# EAGLE board gd32 (EAGLE 9.6.2), part 1 of 2
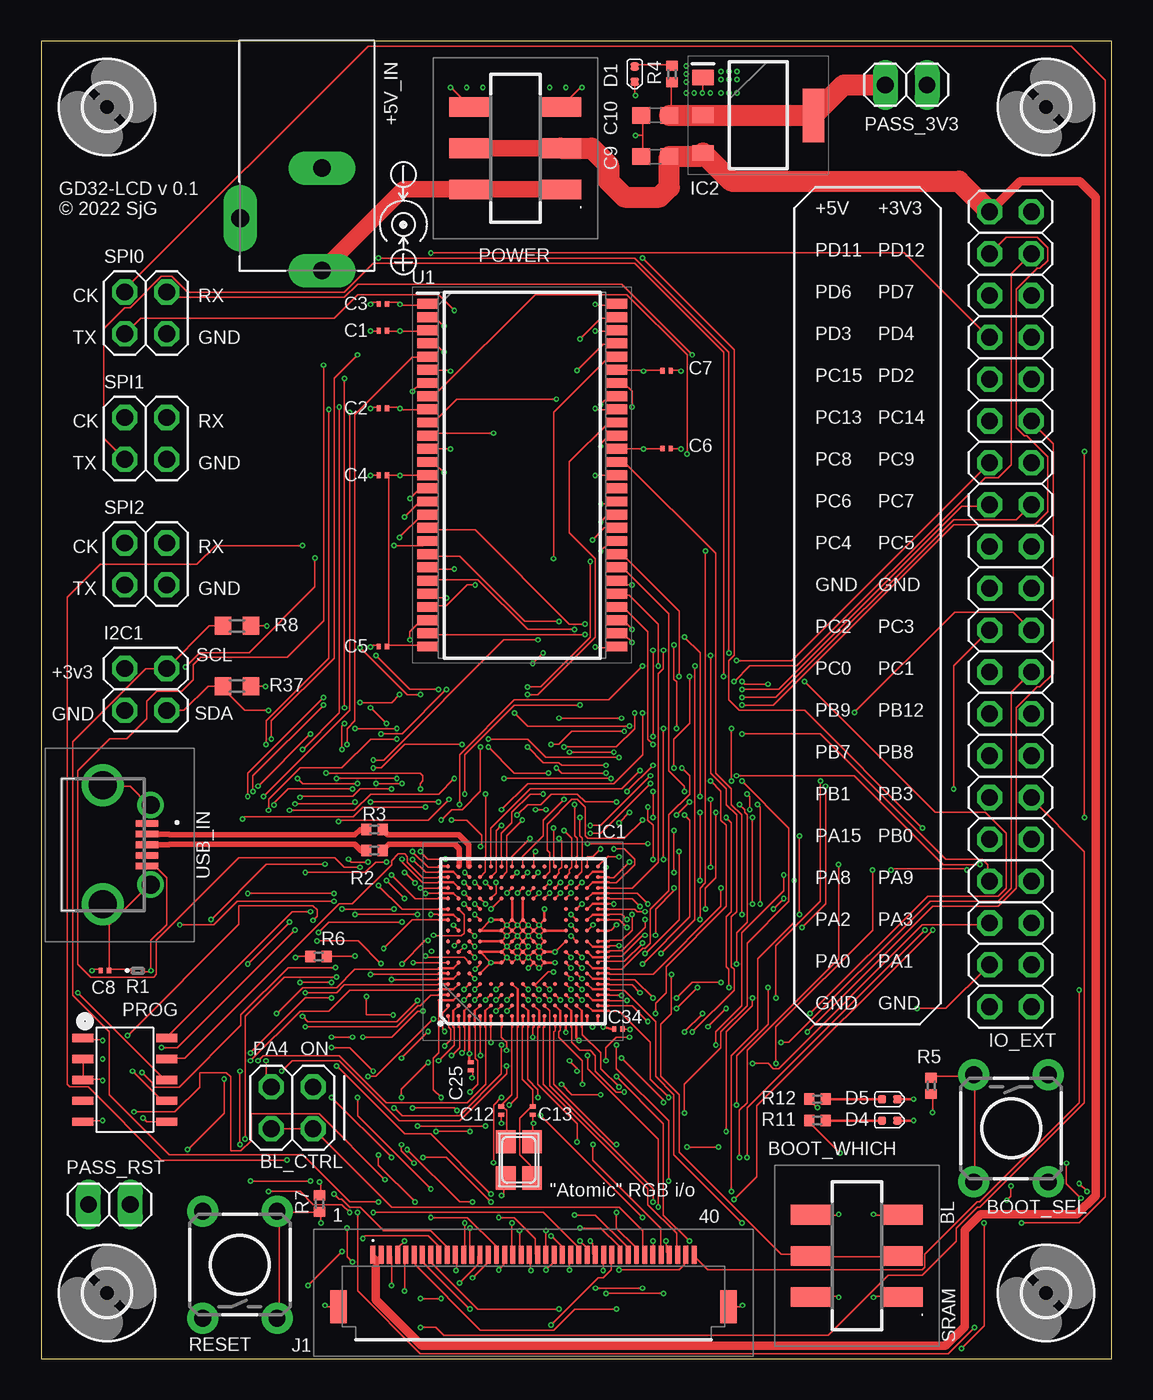
[diagram p5: board, top side]
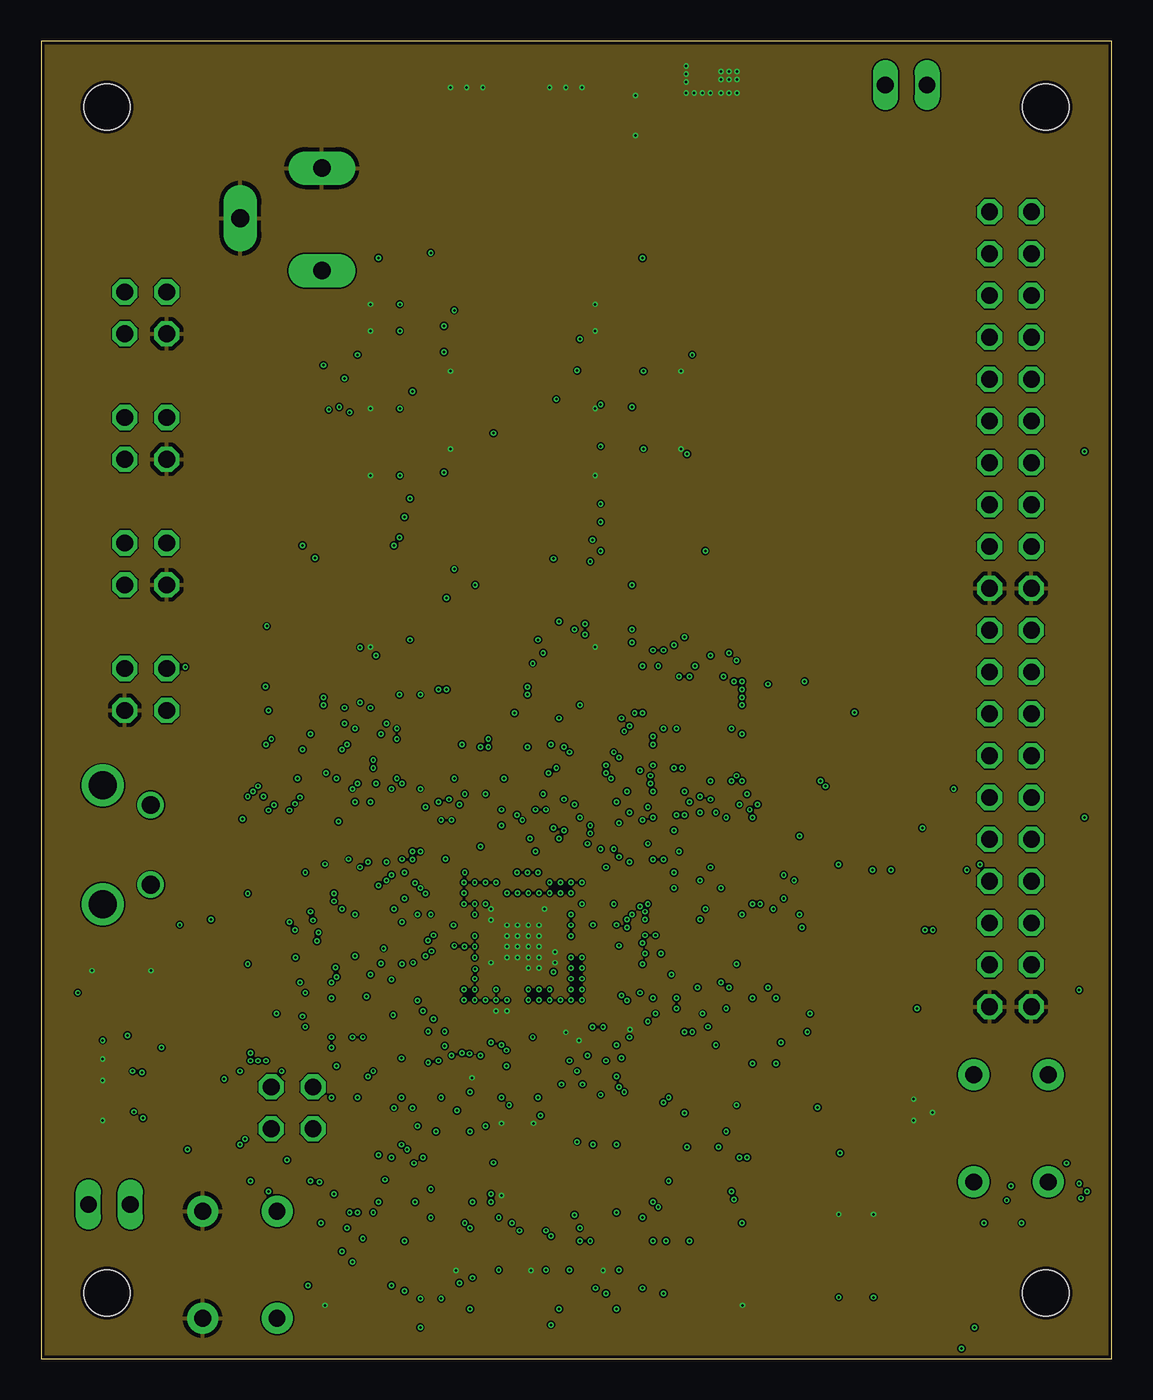
[diagram p6: board, inner layer Route2]
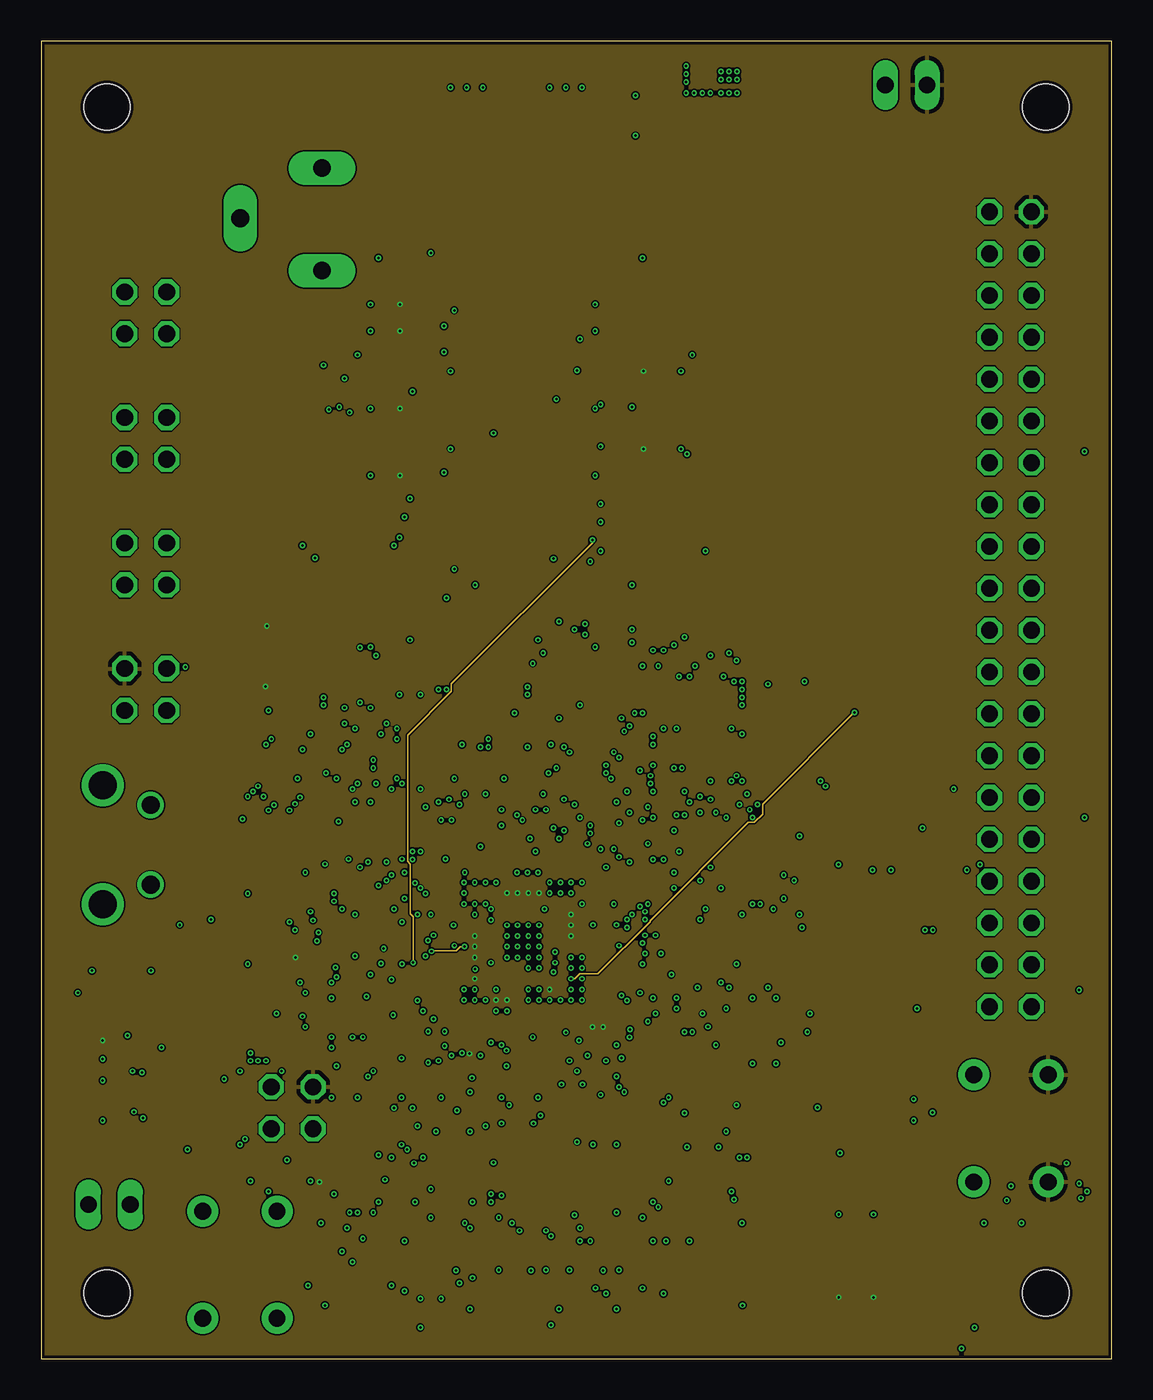
[diagram p7: board, inner layer Route15]
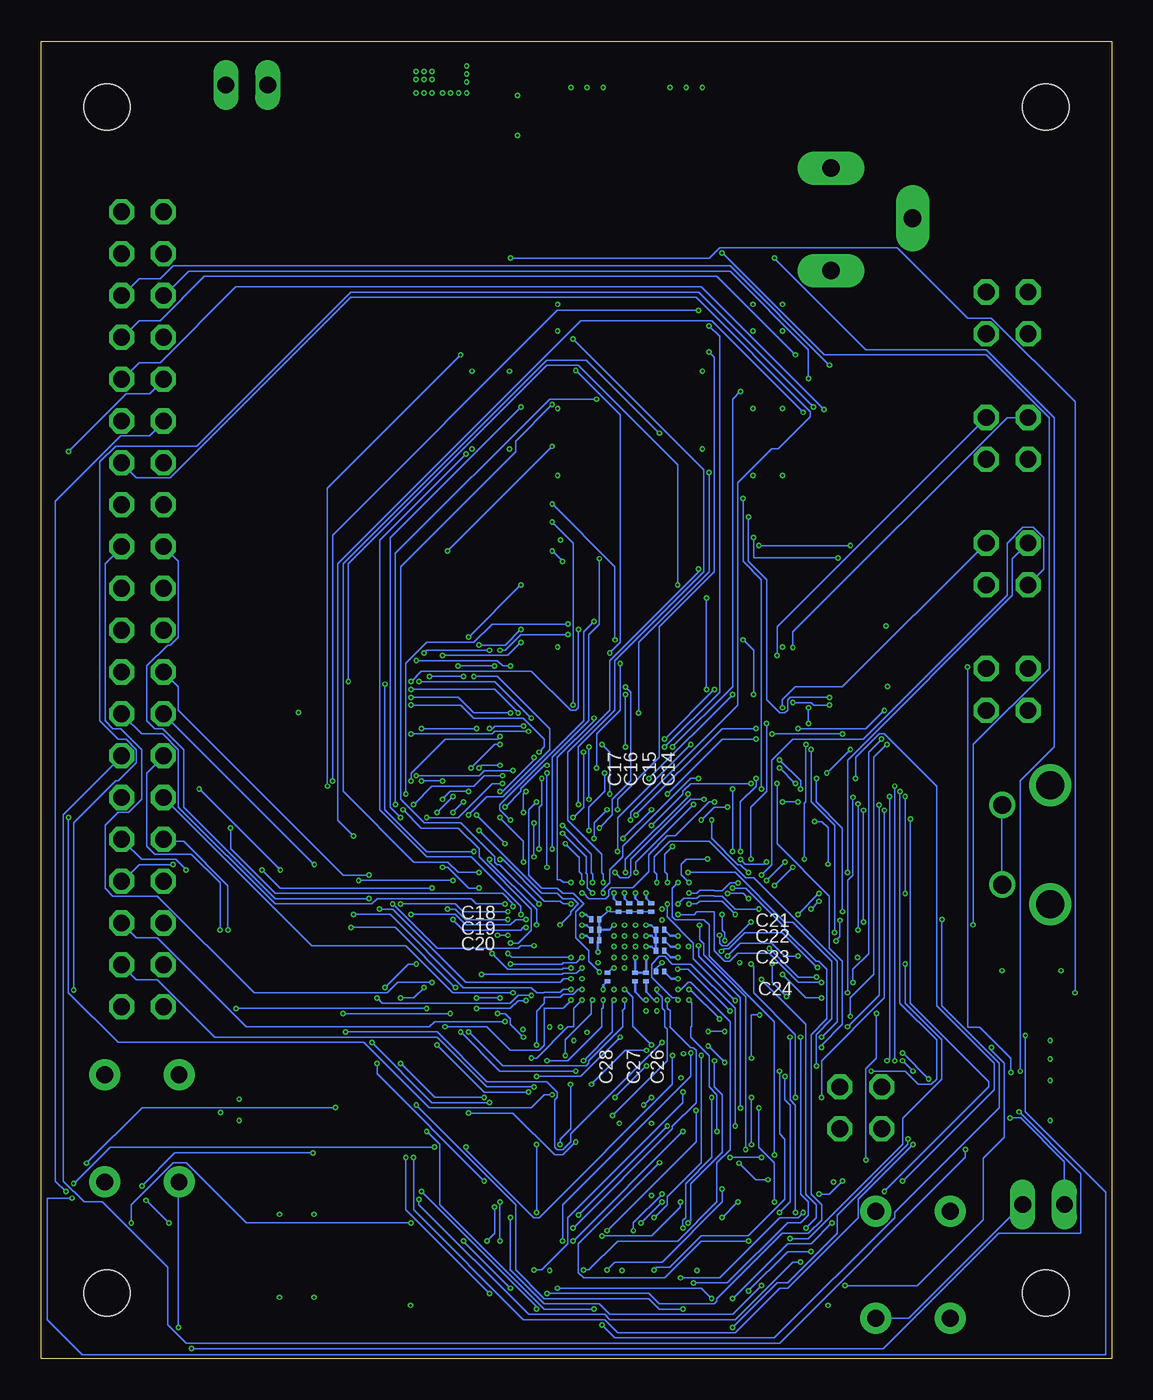
[diagram p8: board, bottom side, seen from below]

Size 65 x 80 mm. Coordinates in mm from the lower left corner, seen from the top.
Outline: 0,0 65,0 65,80 0,80 0,0
Copper layers (1+2*15+16): Top 0.0175mm / dielectric 0.12mm / Route2 0.0175mm / dielectric 0.465mm / Route15 0.0175mm / dielectric 0.12mm / Bottom 0.035mm
Design rules "nextpcb-3.5mil-4layer *": minimum track width 3.5mil, minimum drill 0.15mm, track to track 3.5mil, track to pad 3.5mil, pad to pad 3.5mil, via to via 3.5mil, smd to smd 3.5mil, copper to edge 0.2mm, drill to drill 3.5mil, minimum pad ring 3.5mil, minimum via ring 3.5mil, stop-mask expansion 4mil, vias tented up to drill 0mil, thermal gap 10mil
Net classes: 0 default: width 0.089 mm; 1 USB: width 0.33 mm, clearance 0.102 mm to class 0, clearance 0.254 mm

## Footprints (pad centres in the part's own frame; a part is rotated, then mirrored left to right if it is on the bottom)
DCJ3P-14.2X11.0X9.0MM = drill 1.067 pad 2.032 long: + 3.175,0; -1 -3.048,0; -2 0,-4.953
2X02 = drill 1.016 octagon: 1 -1.27,-1.27; 2 -1.27,1.27; 3 1.27,-1.27; 4 1.27,1.27
TACTILE-PTH = drill 1.016 pad 1.88: 1 -3.251,2.261; 2 3.251,2.261; 3 -3.251,-2.261; 4 3.251,-2.261
JS202011SCQN = smd 1.2 x 2.5: 1 -2.5,-2.75; 2 0,-2.75; 3 2.5,-2.75; 4 2.5,2.75; 5 0,2.75; 6 -2.5,2.75
C0201 = smd 0.25 x 0.35: 1 -0.25,0; 2 0.25,0
C0603 = smd 1.1 x 1: 1 -0.85,0; 2 0.85,0
LED-0402 = smd 0.5 x 0.5: + -0.463,0; - 0.463,0
2,8 = hole 2.8: 0,0
BGA201C65P15X15_1000X1000X84 = smd 0.25 x 0.25: A1 -4.55,4.55; A2 -3.9,4.55; A3 -3.25,4.55; A4 -2.6,4.55; A5 -1.95,4.55; A6 -1.3,4.55; A7 -0.65,4.55; A8 0,4.55; A9 0.65,4.55; A10 1.3,4.55; A11 1.95,4.55; A12 2.6,4.55; A13 3.25,4.55; A14 3.9,4.55; A15 4.55,4.55; B1 -4.55,3.9; B2 -3.9,3.9; B3 -3.25,3.9; B4 -2.6,3.9; B5 -1.95,3.9; B6 -1.3,3.9; B7 -0.65,3.9; B8 0,3.9; B9 0.65,3.9; B10 1.3,3.9; B11 1.95,3.9; B12 2.6,3.9; B13 3.25,3.9; B14 3.9,3.9; B15 4.55,3.9; C1 -4.55,3.25; C2 -3.9,3.25; C3 -3.25,3.25; C4 -2.6,3.25; C5 -1.95,3.25; C6 -1.3,3.25; C7 -0.65,3.25; C8 0,3.25; C9 0.65,3.25; C10 1.3,3.25; C11 1.95,3.25; C12 2.6,3.25; C13 3.25,3.25; C14 3.9,3.25; C15 4.55,3.25; D1 -4.55,2.6; D2 -3.9,2.6; D3 -3.25,2.6; D4 -2.6,2.6; D5 -1.95,2.6; D6 -1.3,2.6; D7 -0.65,2.6; D8 0,2.6; D9 0.65,2.6; D10 1.3,2.6; D11 1.95,2.6; D12 2.6,2.6; D13 3.25,2.6; D14 3.9,2.6; D15 4.55,2.6; E1 -4.55,1.95; E2 -3.9,1.95; E3 -3.25,1.95; E4 -2.6,1.95; E12 2.6,1.95; E13 3.25,1.95; E14 3.9,1.95; E15 4.55,1.95; F1 -4.55,1.3; F2 -3.9,1.3; F3 -3.25,1.3; F4 -2.6,1.3; F6 -1.3,1.3; F7 -0.65,1.3; F8 0,1.3; F9 0.65,1.3; F10 1.3,1.3; F12 2.6,1.3; F13 3.25,1.3; F14 3.9,1.3; F15 4.55,1.3; G1 -4.55,0.65; G2 -3.9,0.65; G3 -3.25,0.65; G4 -2.6,0.65; G6 -1.3,0.65; G7 -0.65,0.65; G8 0,0.65; G9 0.65,0.65; G10 1.3,0.65; G12 2.6,0.65; G13 3.25,0.65; G14 3.9,0.65; G15 4.55,0.65; H1 -4.55,0; H2 -3.9,0; H3 -3.25,0; H4 -2.6,0; H6 -1.3,0; H7 -0.65,0; H8 0,0; H9 0.65,0; H10 1.3,0; H12 2.6,0; H13 3.25,0; H14 3.9,0; H15 4.55,0; J1 -4.55,-0.65; J2 -3.9,-0.65; J3 -3.25,-0.65; J4 -2.6,-0.65; J6 -1.3,-0.65; J7 -0.65,-0.65; J8 0,-0.65; J9 0.65,-0.65; J10 1.3,-0.65; J12 2.6,-0.65; J13 3.25,-0.65; J14 3.9,-0.65; J15 4.55,-0.65; K1 -4.55,-1.3; K2 -3.9,-1.3; K3 -3.25,-1.3; K4 -2.6,-1.3; K6 -1.3,-1.3; K7 -0.65,-1.3; K8 0,-1.3; K9 0.65,-1.3; K10 1.3,-1.3; K12 2.6,-1.3; K13 3.25,-1.3; K14 3.9,-1.3; K15 4.55,-1.3; L1 -4.55,-1.95; L2 -3.9,-1.95; L3 -3.25,-1.95; L4 -2.6,-1.95; L12 2.6,-1.95; L13 3.25,-1.95; L14 3.9,-1.95; L15 4.55,-1.95; M1 -4.55,-2.6; M2 -3.9,-2.6; M3 -3.25,-2.6; M4 -2.6,-2.6; M5 -1.95,-2.6; M6 -1.3,-2.6; M7 -0.65,-2.6; M8 0,-2.6; M9 0.65,-2.6; M10 1.3,-2.6; M11 1.95,-2.6; M12 2.6,-2.6; M13 3.25,-2.6; M14 3.9,-2.6; M15 4.55,-2.6; N1 -4.55,-3.25; N2 -3.9,-3.25; N3 -3.25,-3.25; N4 -2.6,-3.25; N5 -1.95,-3.25; N6 -1.3,-3.25; N7 -0.65,-3.25; N8 0,-3.25; N9 0.65,-3.25; N10 1.3,-3.25; N11 1.95,-3.25; N12 2.6,-3.25; N13 3.25,-3.25; N14 3.9,-3.25; N15 4.55,-3.25; P1 -4.55,-3.9; P2 -3.9,-3.9; P3 -3.25,-3.9; P4 -2.6,-3.9; P5 -1.95,-3.9; P6 -1.3,-3.9; P7 -0.65,-3.9; P8 0,-3.9; P9 0.65,-3.9; P10 1.3,-3.9; P11 1.95,-3.9; P12 2.6,-3.9; P13 3.25,-3.9; P14 3.9,-3.9; P15 4.55,-3.9; R1 -4.55,-4.55; R2 -3.9,-4.55; R3 -3.25,-4.55; R4 -2.6,-4.55; R5 -1.95,-4.55; R6 -1.3,-4.55; R7 -0.65,-4.55; R8 0,-4.55; R9 0.65,-4.55; R10 1.3,-4.55; R11 1.95,-4.55; R12 2.6,-4.55; R13 3.25,-4.55; R14 3.9,-4.55; R15 4.55,-4.55
SOT229P700X180-4N = smd 1.3 x 0.95: 1 -3.35,2.29; 2 -3.35,0; 3 -3.35,-2.29 | smd 1.3 x 3.25: 4 3.35,0
2X20 = drill 1.016 octagon: 1 -24.13,-1.27; 2 -24.13,1.27; 3 -21.59,-1.27; 4 -21.59,1.27; 5 -19.05,-1.27; 6 -19.05,1.27; 7 -16.51,-1.27; 8 -16.51,1.27; 9 -13.97,-1.27; 10 -13.97,1.27; 11 -11.43,-1.27; 12 -11.43,1.27; 13 -8.89,-1.27; 14 -8.89,1.27; 15 -6.35,-1.27; 16 -6.35,1.27; 17 -3.81,-1.27; 18 -3.81,1.27; 19 -1.27,-1.27; 20 -1.27,1.27; 21 1.27,-1.27; 22 1.27,1.27; 23 3.81,-1.27; 24 3.81,1.27; 25 6.35,-1.27; 26 6.35,1.27; 27 8.89,-1.27; 28 8.89,1.27; 29 11.43,-1.27; 30 11.43,1.27; 31 13.97,-1.27; 32 13.97,1.27; 33 16.51,-1.27; 34 16.51,1.27; 35 19.05,-1.27; 36 19.05,1.27; 37 21.59,-1.27; 38 21.59,1.27; 39 24.13,-1.27; 40 24.13,1.27
CF5040FD0R005NH = smd 0.3 x 1.1: 1 -9.75,2.575; 2 -9.25,2.575; 3 -8.75,2.575; 4 -8.25,2.575; 5 -7.75,2.575; 6 -7.25,2.575; 7 -6.75,2.575; 8 -6.25,2.575; 9 -5.75,2.575; 10 -5.25,2.575; 11 -4.75,2.575; 12 -4.25,2.575; 13 -3.75,2.575; 14 -3.25,2.575; 15 -2.75,2.575; 16 -2.25,2.575; 17 -1.75,2.575; 18 -1.25,2.575; 19 -0.75,2.575; 20 -0.25,2.575; 21 0.25,2.575; 22 0.75,2.575; 23 1.25,2.575; 24 1.75,2.575; 25 2.25,2.575; 26 2.75,2.575; 27 3.25,2.575; 28 3.75,2.575; 29 4.25,2.575; 30 4.75,2.575; 31 5.25,2.575; 32 5.75,2.575; 33 6.25,2.575; 34 6.75,2.575; 35 7.25,2.575; 36 7.75,2.575; 37 8.25,2.575; 38 8.75,2.575; 39 9.25,2.575; 40 9.75,2.575 | smd 1 x 2: MP1 -11.85,-0.575; MP2 11.85,-0.575
1X02 = drill 1.016 long: 1 -1.27,0; 2 1.27,0
SWD_DEBUG = smd 0.508 x 1.27: P1 -2.54,-2.54; P2 -2.54,2.54; P3 -1.27,-2.54; P4 -1.27,2.54; P5 0,-2.54; P6 0,2.54; P7 1.27,-2.54; P8 1.27,2.54; P9 2.54,-2.54; P10 2.54,2.54
NX3225 = smd 1.4 x 1.2: 1 -1.1,-0.8; 2 1.1,-0.8; 3 1.1,0.8; 4 -1.1,0.8
ERJ1GN_(0201) = smd 0.25 x 0.3: 1 -0.3,0; 2 0.3,0
R0402 = smd 0.6 x 0.7: 1 -0.5,0; 2 0.5,0
R0603 = smd 1 x 1.1: 1 -0.85,0; 2 0.85,0
SOP80P1176X120-54N = smd 1.295 x 0.6: 1 -5.728,10.4; 2 -5.728,9.6; 3 -5.728,8.8; 4 -5.728,8; 5 -5.728,7.2; 6 -5.728,6.4; 7 -5.728,5.6; 8 -5.728,4.8; 9 -5.728,4; 10 -5.728,3.2; 11 -5.728,2.4; 12 -5.728,1.6; 13 -5.728,0.8; 14 -5.728,0; 15 -5.728,-0.8; 16 -5.728,-1.6; 17 -5.728,-2.4; 18 -5.728,-3.2; 19 -5.728,-4; 20 -5.728,-4.8; 21 -5.728,-5.6; 22 -5.728,-6.4; 23 -5.728,-7.2; 24 -5.728,-8; 25 -5.728,-8.8; 26 -5.728,-9.6; 27 -5.728,-10.4; 28 5.728,-10.4; 29 5.728,-9.6; 30 5.728,-8.8; 31 5.728,-8; 32 5.728,-7.2; 33 5.728,-6.4; 34 5.728,-5.6; 35 5.728,-4.8; 36 5.728,-4; 37 5.728,-3.2; 38 5.728,-2.4; 39 5.728,-1.6; 40 5.728,-0.8; 41 5.728,0; 42 5.728,0.8; 43 5.728,1.6; 44 5.728,2.4; 45 5.728,3.2; 46 5.728,4; 47 5.728,4.8; 48 5.728,5.6; 49 5.728,6.4; 50 5.728,7.2; 51 5.728,8; 52 5.728,8.8; 53 5.728,9.6; 54 5.728,10.4
U254051T4BHJ25S2S = smd 0.4 x 1.35: 1 -1.3,0.675; 2 -0.65,0.675; 3 0,0.675; 4 0.65,0.675; 5 1.3,0.675 | drill 1.7 pad 2.3: MH1 -3.6,-2; MH2 3.6,-2 | drill 1.07 pad 1.4: MH3 2.425,0.9; MH4 -2.425,0.9

## Placement (x,y rotation side)
+5V_IN  DC-005  [DCJ3P-14.2X11.0X9.0MM]  17.04,69.25 270 top
BL_CTRL  [2X02]  15.24,15.24 180 top
BOOT_SEL  B3F-1005  [TACTILE-PTH]  58.88,13.99 270 top
BOOT_WHICH  JS202011SCQN  [JS202011SCQN]  49.52,6.25 90 top
C1  0.1uF  [C0201]  20.75,62.42 180 top
C2  0.1uF  [C0201]  20.75,57.71 180 top
C3  0.1uF  [C0201]  20.75,64.05 180 top
C4  0.1uF  [C0201]  20.75,53.65 180 top
C5  0.1uF  [C0201]  20.75,43.25 180 top
C6  0.1uF  [C0201]  37.98,55.27 0 top
C7  0.1uF  [C0201]  37.98,59.99 0 top
C8  4.7nF / 50V  [C0201]  3.87,23.57 180 top
C9  10uF/16v  [C0603]  37.29,73 180 top
C10  10uF/16v  [C0603]  37.29,75.5 180 top
C12  15pF  [C0201]  27.94,15.07 270 top
C13  15pF  [C0201]  29.84,15.07 270 top
C14  0.1uF  [C0201]  27.96,27.4 270 bottom
C15  0.1uF  [C0201]  28.62,27.4 270 bottom
C16  0.1uF  [C0201]  29.29,27.4 270 bottom
C17  0.1uF  [C0201]  29.95,27.4 270 bottom
C18  0.1uF  [C0201]  31.36,26.68 0 bottom
C19  0.1uF  [C0201]  31.36,26.05 0 bottom
C20  0.1uF  [C0201]  31.36,25.41 0 bottom
C21  0.1uF  [C0201]  27.43,26.05 180 bottom
C22  0.1uF  [C0201]  27.43,25.41 180 bottom
C23  0.1uF  [C0201]  27.43,24.78 180 bottom
C24  0.1uF  [C0201]  27.43,23.51 180 bottom
C25  0.1uF  [C0201]  26.08,17.77 270 top
C26  0.1uF  [C0201]  28.28,23.18 90 bottom
C27  0.1uF  [C0201]  28.94,23.18 90 bottom
C28  0.1uF  [C0201]  30.61,23.18 90 bottom
C34  0.1uF  [C0201]  35.05,20.02 0 top
D1  GRN-0402  [LED-0402]  36.04,78 270 top
D4  GRN-0402  [LED-0402]  51.51,14.46 0 top
D5  GRN-0402  [LED-0402]  51.51,15.76 0 top
H1  MOUNT-HOLE2.8  [2,8]  4,76 0 top
H2  MOUNT-HOLE2.8  [2,8]  4,4 0 top
H3  MOUNT-HOLE2.8  [2,8]  61,4 0 top
H4  MOUNT-HOLE2.8  [2,8]  61,76 0 top
I2C1  [2X02]  6.35,40.64 270 top
IC1  GD32F450  [BGA201C65P15X15_1000X1000X84]  29.25,25.35 90 top
IC2  AMS1117-3.3  [SOT229P700X180-4N]  43.54,75.5 0 top
IO_EXT  [2X20]  58.85,45.51 270 top
J1  LCD  [CF5040FD0R005NH]  29.89,3.73 0 top
PASS_3V3  [1X02]  52.52,77.34 180 top
PASS_RST  [1X02]  4.14,9.37 0 top
POWER  JS202011SCQN  [JS202011SCQN]  28.79,73.5 90 top
PROG  GD32_DEBUG  [SWD_DEBUG]  5.08,16.93 270 top
Q2  8MHz  [NX3225]  29,12.08 270 top
R1  1M  [ERJ1GN_(0201)]  5.87,23.57 0 top
R2  22R  [R0402]  20.23,30.86 180 top
R3  22R  [R0402]  20.23,32.13 180 top
R4  470R  [R0402]  38.29,78 90 top
R5  10K  [R0402]  54.04,16.57 90 top
R6  10K  [R0402]  16.85,24.43 180 top
R7  10K  [R0402]  16.9,9.43 90 top
R8  1K5  [R0603]  11.89,44.5 0 top
R11  470R  [R0402]  47.12,14.46 0 top
R12  470R  [R0402]  47.12,15.76 0 top
R37  1K5  [R0603]  11.89,40.84 0 top
RESET  B3F-1005  [TACTILE-PTH]  12.06,5.71 90 top
SPI0  [2X02]  6.35,63.5 0 top
SPI1  [2X02]  6.35,55.88 0 top
SPI2  [2X02]  6.35,48.26 0 top
U1  W9825G6KH-5  [SOP80P1176X120-54N]  29.2,53.65 0 top
USB_IN  U254-051T-4BHJ25-S2S  [U254051T4BHJ25S2S]  5.75,31.21 270 top

## Tracks (layer width: path | path; a pad name or v marks a point on that pad's centre or on a via)
!RST!  (via drill 0.15)
  Top 0.089: 14.45,8.89 14.45,2.54 RESET.3 | v29.84,19.53 29.84,20.16 29.9,20.16 | v34.92,17.14 37.78,14.29 37.78,8.73 v39.37,7.14 | v33.66,4.29 v36.51,4.29 | v23.02,3.65 v24.29,3.65 | v16.99,8.26 16.99,8.89 R7.1 16.83,8.89 14.45,8.89 | 14.45,8.89 RESET.4
  Top 0.152: IC1.J1 29.9,20.16
  Bottom 0.089: v29.84,19.53 32.23,17.14 v34.92,17.14 | v36.51,4.29 v39.37,7.14 | v33.66,4.29 24.92,4.29 v24.29,3.65 | v23.02,3.65 19.68,6.99 18.26,6.99 v16.99,8.26 | PASS_RST.2 12.32,2.46 RESET.3
+3V3  (via drill 0.15)
  Top 0.089: 21.11,43.34 23.34,43.34 U1.27 | C6.1 37.62,55.24 36.67,55.24 v36.56,55.25 36.51,55.24 35.08,55.24 U1.43 | C2.1 21.11,57.78 21.75,57.78 v21.77,57.69 21.91,57.63 23.34,57.63 U1.9 | C7.1 37.62,60.01 36.67,60.01 v36.56,59.96 36.51,60.01 35.08,60.01 U1.49 | C1.1 21.11,62.39 21.75,62.39 v21.77,62.4 21.91,62.39 23.34,62.39 U1.3 | C3.1 21.11,64.14 21.75,64.14 v21.77,64.03 21.91,63.98 23.34,63.98 U1.1 | R7.2 16.99,10 16.99,10.64 v16.9,10.72 | R6.2 16.19,24.45 15.56,24.45 v15.44,24.38 | PROG.P1 2.54,19.37 3.65,19.37 v3.74,19.34 | U1.14 23.34,53.66 21.91,53.66 v21.77,53.62 21.75,53.66 21.11,53.66 C4.1 21.11,53.5 21.11,43.34 | 21.11,43.34 C5.1 | BOOT_WHICH.6 46.83,3.81 48.42,3.81 v48.42,3.74 | BOOT_WHICH.1 52.23,3.81 50.64,3.81 v50.54,3.74 | R8.2 13.68,44.5 v13.7,44.48 | R37.2 13.6,40.84 v13.62,40.82
  Top 0.152: IC1.C9 v26.32,25.68 | IC1.C8 v26.32,25.02 | IC1.C7 v26.32,24.38 | IC1.C5 v26.32,23.07 | IC1.F3 v27.62,21.77 | IC1.G3 v28.27,21.77 | IC1.K4 v30.88,22.43 | IC1.N8 v32.17,25.68 | IC1.N9 v32.17,26.32 | IC1.N10 v32.17,26.98 | IC1.J13 v29.57,28.27 | IC1.H13 v28.93,28.27 | IC1.G13 v28.27,28.27 | IC1.J12 v30.23,28.27 | IC1.P1 33.15,20.48 v33.48,20.15 | IC1.R1 33.8,20.48 v34.12,20.15 34.77,19.99 C34.1 | IC1.C1 v26,18.52 26,18.09 C25.1
  Bottom 0.152: C21.1 26.8,25.68 v26.32,25.68 | C22.1 26.79,25.02 v26.32,25.02 | C23.1 26.77,24.38 v26.32,24.38 | C24.1 26.74,23.07 v26.32,23.07 | v27.62,21.77 27.77,21.77 28.28,22.29 C26.1 | C27.1 28.94,22.29 28.43,21.77 v28.27,21.77 | C28.1 30.88,22.67 v30.88,22.43 | C20.1 31.87,25.68 v32.17,25.68 | C19.1 31.89,26.32 v32.17,26.32 | C18.1 31.9,26.98 v32.17,26.98 | C16.1 29.57,27.93 v29.57,28.27 | C15.1 28.93,27.95 v28.93,28.27 | C14.1 28.27,27.96 v28.27,28.27 | C17.1 30.23,27.92 v30.23,28.27
  pour Route15: -3,83 68,83 68,-2 -3,-2
+5V
  Top 0.254: 20.31,5.53 20.31,5.56 | J1.1 20.31,6.14 20.31,5.56 | 20.31,5.56 J1.2
  Top 0.508: IO_EXT.1 59.44,71.5 63.05,71.5 64.03,70.53 64.03,9.91 62.89,8.78 57.04,8.78 56.06,7.8 56.06,1.95 54.9,0.78 23.11,0.78 20.31,3.58 20.31,5.53
  Top 1.016: 39.98,73 IC2.3 | POWER.5 POWER.2
  Top 1.27: POWER.2 33.42,73.5 34.45,72.47 34.45,71.5 35.42,70.53 37.54,70.53 38.14,71.13 C9.1 39.98,73 | IC2.3 41.9,71.5 55.72,71.5 IO_EXT.1
BOOT0  (via drill 0.15)
  Top 0.089: R5.2 54.13,17.14 56.52,17.14 BOOT_SEL.3 56.67,17.14 56.67,10.79 BOOT_SEL.4 | v26.35,23.65 26.67,23.97 IC1.D6 | v23.18,21.11 22.86,21.11 21.27,19.53 v19.53,19.53 | v19.21,8.89 19.21,4.13 23.02,0.32 55.09,0.32 v56.67,1.91
  Bottom 0.089: v26.35,23.65 25.72,23.65 v23.18,21.11 | v19.53,19.53 19.53,15.72 19.21,15.4 v19.21,8.89 | v56.67,1.91 56.67,10.64 BOOT_SEL.4
GND  (via drill 0.15)
  Top 0.089: 36.51,74.3 36.51,75.41 C10.2 | 36.51,74.3 36.51,73.03 C9.2 | 2.54,16.99 2.54,18.1 PROG.P3 | R1.2 6.19,23.5 6.51,23.5 v6.66,23.56 6.67,23.65 6.67,25.4 7.62,26.35 7.62,29.21 6.99,29.84 6.51,29.84 USB_IN.5 | C8.2 3.49,23.65 3.17,23.65 v3.09,23.56 | C25.2 26.19,17.46 26.19,17.14 v26.16,17.06 | C12.2 27.94,14.45 v27.95,14.3 | C13.2 29.84,14.45 v29.9,14.3 29.84,14.29 29.84,13.34 Q2.4 | C34.2 35.4,20 35.72,20 v35.75,19.99 | C5.2 20.48,43.34 20,43.34 v19.99,43.23 | C4.2 20.48,53.66 20,53.66 v19.99,53.62 | C2.2 20.48,57.78 20,57.78 v19.99,57.69 | C6.2 38.26,55.24 38.73,55.24 v38.84,55.25 | C7.2 38.26,60.01 38.73,60.01 v38.84,59.96 | C1.2 20.48,62.39 20,62.39 v19.99,62.4 | C3.2 20.48,64.14 20,64.14 v19.99,64.03 | D1.- 36.04,77.47 36.04,76.83 v36.08,76.7 | R5.1 54.13,16.03 54.13,15.08 v54.11,14.95 | J1.11 25.24,6.19 25.24,5.4 v25.19,5.36 | J1.20 29.69,6.19 29.69,5.4 v29.74,5.36 | J1.29 34.13,6.19 34.13,5.4 v34.12,5.36 | PROG.P9 2.54,14.45 3.65,14.45 v3.74,14.46 | U1.28 34.92,43.18 33.66,43.18 v33.64,43.23 | U1.12 23.5,55.24 24.77,55.24 v24.86,55.25 | U1.6 23.5,60.01 24.77,60.01 v24.86,59.96 | U1.41 33.66,53.66 v33.64,53.62 | U1.46 34.92,57.63 33.66,57.63 v33.64,57.69 | U1.52 34.92,62.39 33.66,62.39 v33.64,62.4 | U1.54 34.92,63.98 33.66,63.98 v33.64,64.03 | IC2.1 40.16,77.79 40.16,76.99 v40.14,76.86 | Q2.2 28.1,10.95 28.1,9.84 v27.95,9.91 | 2.54,16.99 3.65,16.99 v3.74,16.9 | 2.54,16.99 PROG.P5 | 36.51,74.3 36.2,74.3 v36.08,74.26 | J1.MP1 17.94,3.17 17.3,3.17 v17.23,3.25 | J1.MP2 41.75,3.17 42.55,3.17 v42.58,3.25 | BOOT_WHICH.4 46.83,8.73 48.42,8.73 v48.42,8.78 | BOOT_WHICH.3 52.23,8.73 50.64,8.73 v50.54,8.78
  Top 0.089: POWER.4 26.04,76.04 24.92,77.15 v24.86,77.19 | POWER.3 31.59,76.04 32.7,77.15 v32.83,77.19
  Top 0.152: IC1.F12 v27.3,27.3 | IC1.G12 IC1.G10 | IC1.H12 IC1.H10 | IC1.J10 v30.23,26.32 | v30.23,26.32 IC1.K10 v30.55,27.3 | IC1.H10 v29.57,26.32 | IC1.H10 v28.93,26.32 | IC1.G10 v28.93,26.32 | IC1.G10 v28.27,26.32 | v28.27,26.32 IC1.F10 v27.3,26.65 IC1.D9 IC1.F9 | IC1.F9 v28.27,26.32 | IC1.F9 v28.27,25.68 | IC1.F8 v28.27,25.68 | IC1.F8 v28.27,25.02 | IC1.F7 v28.27,25.02 | IC1.F7 v28.27,24.38 | v28.27,24.38 IC1.F6 v27.3,24.05 | v28.27,24.38 IC1.G6 v28.93,24.38 | v28.93,24.38 IC1.H6 v29.57,24.38 | IC1.J6 v29.57,24.38 | IC1.J6 v29.57,23.73 | IC1.J6 v30.23,23.73 IC1.K6 | IC1.K6 v30.23,24.38 | v30.23,24.38 IC1.K7 | IC1.K7 v30.23,25.02 | v30.23,25.02 IC1.K8 v30.23,25.68 | v30.23,25.68 IC1.K9 | IC1.K9 v30.23,26.32 | v30.23,26.32 IC1.J9 | v29.57,26.32 IC1.J9 | v30.23,25.68 IC1.J9 | v29.57,25.68 IC1.J9 | v29.57,25.68 IC1.H9 | v28.93,26.32 IC1.H9 | v28.93,26.32 IC1.G9 | IC1.G9 v28.27,26.32 | v28.27,25.68 IC1.G9 | IC1.G9 v28.93,25.68 | v28.93,25.68 IC1.H8 | v28.93,25.68 IC1.H9 | IC1.H9 v29.57,26.32 | v28.93,25.68 IC1.G8 v28.27,25.02 | v28.27,25.02 IC1.G7 | IC1.G7 v28.93,25.02 | v28.93,25.02 IC1.H8 | IC1.H8 v29.57,25.68 | v29.57,25.68 IC1.J8 v30.23,25.02 | v30.23,25.02 IC1.J7 | IC1.J7 v30.23,24.38 | IC1.J7 v29.57,24.38 | v29.57,24.38 IC1.H7 | IC1.H7 v29.57,25.02 IC1.H8 | v28.93,25.02 IC1.H7 | IC1.H7 v28.93,24.38 | IC1.G7 v28.93,24.38 | IC1.K7 v31.2,24.7 IC1.M8 | v31.2,24.05 IC1.K6 | IC1.D5 v27.3,24.05 | IC1.D8 IC1.F8 | v27.3,24.05 IC1.D7 IC1.F7 | IC1.M9 IC1.K9 | IC1.F2 v27.62,21.12 | IC1.G2 v28.27,21.12 | IC1.M1 v31.85,19.82 | IC1.N1 32.5,19.5 v32.66,19.34 | D5.- v52.98,15.76 | v52.98,14.46 D4.-
  Bottom 0.089: C14.2 28.1,27.15 28.57,27.15 C15.2 28.73,27.15 29.21,27.15 C16.2 29.37,27.15 29.84,27.15 C17.2 30,27.15 30.48,27.15 v30.55,27.3
  Bottom 0.152: v28.27,26.32 27.95,26.32 C21.2 C22.2 | C22.2 27.93,25.68 v28.27,25.68 | v28.27,25.02 27.92,25.02 C23.2 C22.2 | C24.2 27.68,23.68 v27.3,24.05 | v28.27,24.38 v28.28,24.37 C26.2 C27.2 28.94,24.36 v28.93,24.38 | C28.2 30.32,23.73 v30.23,23.73 | v31.2,24.7 31.2,25.32 C20.2 C19.2 | C19.2 30.5,26.05 v30.23,26.32 | v30.55,27.3 30.55,27.25 C18.2 C19.2
  other vias: 30.88,77.19 31.85,77.19 26.81,77.19 25.84,77.19 41.27,78.16 41.76,78.16 42.25,78.16 42.25,77.67 41.76,77.67 41.27,77.67 39.16,77.51 39.16,78 39.16,78.49 39.16,76.86 39.65,76.86 40.62,76.86 41.27,76.86 41.76,76.86 42.25,76.86 3.74,18.2
  pour Route2: -1.27,81.28 66.04,81.28 66.04,-0.64 -1.27,-0.64
LCD_BL
  Top 0.089: J1.34 36.51,6.35 36.51,7.78 35.08,9.21 21.27,9.21 BL_CTRL.2 BL_CTRL.4
LED0  (via drill 0.15)
  Top 0.089: v24.5,19.88 24.38,20 24.38,21 24.75,21.38 IC1.A2 | v21.88,18.25 v23.5,19.88 | v21.38,20.88 19.75,20.88 v19.75,22 | v20.62,24 19.25,25.38 v16.75,25.38 | v16.5,26.62 16.75,26.88 16.75,27.25 16.5,27.5 12,27.5 12,26.38 v5.25,19.62 | v63.12,9.75 62.25,10.62 v62.25,11.88 | v47.12,15.25 R12.1
  Bottom 0.089: v23.5,19.88 v24.5,19.88 | v21.88,18.25 21.88,20.88 v21.38,20.88 | v19.75,22 20.62,22.88 v20.62,24 | v16.75,25.38 16.5,25.62 v16.5,26.62 | v5.25,19.62 5.25,15 0.38,10.12 0.38,0.25 62.5,0.25 64.62,2.38 64.62,9.75 v63.12,9.75 | v62.25,11.88 58.88,15.25 v47.12,15.25
LED1  (via drill 0.15)
  Top 0.089: v24.5,19 24.88,19.38 24.88,20 24.75,20.12 24.75,20.75 IC1.A1 | v23.5,18 21.88,16.38 v21.88,15.88 | v21.88,13 21.88,12.62 v22.62,11.88 | v20.88,10.88 16.88,14.88 12.75,14.88 12.75,13.25 12.12,12.62 11.5,12.62 11.5,17.12 11.25,17.38 9.62,17.38 9.62,16.5 8.12,15 v5.62,15 | v55.88,0.62 57.25,2 v57.25,8.25 | v58.62,9.62 58.88,9.88 v58.88,10.5 | v48.5,12.5 46.62,14.38 R11.1
  Bottom 0.089: v23.5,18 v24.5,19 | v21.88,13 v21.88,15.88 | v22.62,11.88 21.62,10.88 v20.88,10.88 | v5.62,15 1.88,11.25 1.88,7.62 6.88,7.62 13.88,0.62 v55.88,0.62 | v58.62,9.62 v57.25,8.25 | v58.88,10.5 56.88,12.5 v48.5,12.5
MCU_USB_N
  Top 0.33: IC1.C15 25.97,29.93 25.97,31.22 25.36,31.83 21.04,31.83 R3.1
MCU_USB_P
  Top 0.33: IC1.B15 25.38,29.93 25.38,30.98 25.12,31.24 21.12,31.24 R2.1
N$1
  Top 0.089: 4.13,23.65 5.56,23.65 R1.1 | 4.13,26.35 4.13,27.15 3.81,27.46 USB_IN.MH2 4.13,26.35 | 4.13,26.35 4.13,23.65 | 4.13,23.65 C8.1 | 4.13,26.35 6.51,28.73 USB_IN.MH3 | USB_IN.MH1 3.81,34.77 5.4,34.77 6.51,33.66 USB_IN.MH4
  Bottom 0.089: USB_IN.MH4 6.67,33.5 6.67,28.89 USB_IN.MH3
N$2
  Top 0.089: D1.+ 36.2,78.58 38.26,78.58 R4.2
N$3
  Top 0.089: 38.26,75.5 38.26,77.47 R4.1
  Top 1.27: PASS_3V3.2 48.73,77.34 IC2.4 IC2.2 38.26,75.5 C10.1
N$4  (via drill 0.15)
  Top 0.089: v19.05,24.45 17.46,24.45 R6.1 | IC1.C6 25.68,24.38 23.41,24.38 v23.34,24.45
  Bottom 0.089: v19.05,24.45 19.84,24.45 20.64,25.24 22.54,25.24 v23.34,24.45
N$5  (via drill 0.15)
  Top 0.089: PROG.P10 6.41,14.39 v6.17,14.62
  Bottom 0.089: v6.17,14.62 5.53,14.62 2.87,11.97 PASS_RST.1
N$8
  Top 0.152: D4.+ R11.2
N$9
  Top 0.152: R12.2 D5.+
PA0  (via drill 0.15)
  Top 0.089: v41.59,21.27 v40.48,20.16 | v53.18,21.27 54.93,21.27 57.47,23.81 IO_EXT.37
  Top 0.102: IC1.N3 v32.83,21.77
  Bottom 0.089: 34.45,21.29 34.45,19.05 34.77,18.73 36.51,18.73 37.94,20.16 v40.48,20.16 | v53.18,21.27 v41.59,21.27
  Bottom 0.102: v32.83,21.77 33.31,21.29 34.45,21.29
PA1  (via drill 0.15)
  Top 0.089: v35.08,16.51 33.97,17.62 33.97,18.57 32.86,19.68 32.86,20.16 32.83,20.16
  Top 0.152: IC1.N2 32.83,21.12 32.83,20.16
  Bottom 0.089: v35.08,16.51 37.94,16.51 40.96,19.53 54.45,19.53 57.94,23.02 59.21,23.02 60.01,23.81 IO_EXT.38
PA2  (via drill 0.15)
  Top 0.089: v38.1,15.88 36.99,16.99 36.99,19.21 35.08,21.11 34.45,21.11 34.45,21.12 | v43.18,17.94 44.13,17.94 44.45,17.62 44.77,17.62 53.5,26.35 57.47,26.35 IO_EXT.35
  Top 0.152: IC1.P2 33.48,21.12 34.45,21.12
  Bottom 0.089: v38.1,15.88 41.12,15.88 v43.18,17.94
PA3  (via drill 0.15)
  Top 0.089: v36.83,20.48 35.88,21.43 34.45,21.43 34.45,21.45
  Top 0.152: IC1.R2 34.45,21.45
  Bottom 0.089: v36.83,20.48 41.12,20.48 41.43,20.16 52.55,20.16 57.94,25.56 59.21,25.56 60.01,26.35 IO_EXT.36
PA4  (via drill 0.15)
  Top 0.089: v46.04,31.75 v46.04,26.99 | v18.73,57.47 18.73,39.37 v13.49,34.13 | v13.65,18.1 13.65,16.83 BL_CTRL.3
  Top 0.102: IC1.N4 v32.83,22.43
  Bottom 0.089: v46.04,26.99 43.81,26.99 39.37,22.54 35.24,22.54 34.92,22.23 34.45,22.23 34.45,22.26 | v46.04,31.75 46.99,32.7 46.99,48.26 32.23,63.02 24.29,63.02 v18.73,57.47 | v13.49,34.13 13.49,18.26 v13.65,18.1
  Bottom 0.102: v32.83,22.43 33.31,22.43 33.48,22.26 34.45,22.26
PA5  (via drill 0.15)
  Top 0.089: v42.55,8.26 38.42,12.38 38.42,16.03 37.31,17.14 37.31,20.48 35.4,22.38 34.45,22.38 34.45,22.43 | v59.53,8.26 63.02,8.26 64.61,9.84 64.61,77.63 62.55,79.69 19.84,79.69 5.08,64.93 SPI0.2
  Top 0.152: IC1.P4 33.48,22.43 34.45,22.43
  Bottom 0.089: v42.55,8.26 52.55,8.26 56.2,11.91 56.99,11.91 59.53,9.37 v59.53,8.26
PA6  (via drill 0.15)
  Top 0.089: v35.56,21.75 34.45,21.75 34.45,21.77 | v39.85,22.54 v38.58,21.27 | v46.2,26.19 47.62,27.62 v47.62,34.77 | v39.53,60.96 35.24,65.25 19.21,65.25 18.41,64.45 7.94,64.45 SPI0.4
  Top 0.152: IC1.P3 33.48,21.77 34.45,21.77
  Bottom 0.089: v35.56,21.75 36.04,21.75 36.51,21.27 v38.58,21.27 | v39.85,22.54 43.5,26.19 v46.2,26.19 | v47.62,34.77 47.62,52.86 v39.53,60.96
PA7  (via drill 0.15)
  Top 0.089: v35.24,22.07 34.45,22.07 34.45,22.1 | v44.61,21.91 44.61,25.08 47.31,27.78 v47.31,35.08 | v25.08,63.66 24.13,64.61 19.21,64.61 17.78,63.18 6.03,63.18 SPI0.1
  Top 0.152: IC1.R3 34.45,22.1
  Bottom 0.089: v35.24,22.07 36.04,22.07 36.51,21.59 44.29,21.59 v44.61,21.91 | v47.31,35.08 47.31,50.01 33.66,63.66 v25.08,63.66
PA8  (via drill 0.15)
  Top 0.089: v30.48,34.29 29.69,34.29 28.57,33.18 28.57,32.54 27.94,31.91 27.94,30.48 27.95,30.48 | v30.96,37.31 31.43,37.31 32.23,38.1 v35.4,38.1 | v42.55,37.94 47.31,37.94 54.93,30.32 57.15,30.32 57.47,30 57.47,29.05 IO_EXT.33
  Top 0.102: IC1.F15 27.95,30.48
  Bottom 0.089: v30.48,34.29 30.48,36.83 v30.96,37.31 | v35.4,38.1 37.47,38.1 37.62,37.94 v42.55,37.94
PA9  (via drill 0.15)
  Top 0.089: v36.35,35.72 35.24,34.61 29.69,34.61 27.3,32.23 27.3,30.48 | v42.23,35.4 49.37,35.4 54.77,30 v56.99,30
  Top 0.102: IC1.E15 27.3,30.48
  Bottom 0.089: v36.35,35.72 38.1,35.72 38.42,35.4 v42.23,35.4 | v56.99,30 59.05,30 60.01,29.05 IO_EXT.34
PA13  (via drill 0.15)
  Top 0.089: v22.54,30.8 23.5,29.84 24.13,29.84 24.13,29.9 | v17.94,35.24 v21.59,35.24 | v16.35,27.15 15.24,27.15 7.62,19.53 PROG.P2
  Top 0.152: IC1.A15 24.13,29.9
  Bottom 0.089: v22.54,30.8 22.54,33.81 21.59,34.77 v21.59,35.24 | v17.94,35.24 17.94,33.81 16.35,32.23 v16.35,27.15
PA14
  Top 0.089: 24.13,29.25 24.13,29.21 23.18,29.21 22.23,30.16 22.23,30.49 22.07,30.65 21.67,30.65 21.27,30.25 21.27,30 18.89,27.62 18.1,27.62 8.73,18.26 7.62,18.26 PROG.P4
  Top 0.152: IC1.A14 24.13,29.25
PA15  (via drill 0.15)
  Top 0.089: v23.02,28.57 24.13,28.57 24.13,28.6 | v37.78,3.97 v34.29,3.97 | v42.86,12.22 42.86,15.24 v53.66,26.04
  Top 0.152: IC1.A13 24.13,28.6
  Bottom 0.089: v23.02,28.57 22.23,28.57 19.84,26.19 19.84,26.04 17.94,24.13 17.78,24.13 17.3,23.65 17.3,20.64 18.26,19.68 18.26,10 17.62,9.37 17.62,8.41 18.41,7.62 20,7.62 23.97,3.65 23.97,3.49 24.13,3.33 27.46,3.33 28.1,3.97 v34.29,3.97 | v37.78,3.97 42.86,9.05 v42.86,12.22 | v53.66,26.04 53.66,28.73 56.36,31.43 57.47,31.43 IO_EXT.31
PB0  (via drill 0.15)
  Top 0.089: v41.27,28.57 41.27,27.46 37.15,23.34 34.45,23.34 34.45,23.4 | v56.2,29.69 56.12,29.76 51.68,29.76 v51.6,29.69
  Top 0.152: IC1.R5 34.45,23.4
  Bottom 0.089: v41.27,28.57 50.49,28.57 v51.6,29.69 | v56.2,29.69 56.83,30.32 58.9,30.32 60.01,31.43 IO_EXT.32
PB1  (via drill 0.15)
  Top 0.089: v36.35,22.23 35.88,22.7 34.45,22.7 34.45,22.75
  Top 0.152: IC1.R4 34.45,22.75
  Bottom 0.089: v36.35,22.23 40.01,22.23 42.86,25.08 48.58,25.08 57.47,33.97 IO_EXT.29
PB2  (via drill 0.15)
  Top 0.089: v38.26,23.34 38.26,20.95 37.62,20.32 37.62,17.14 38.73,16.03 38.73,12.54 44.93,6.35 46.67,6.35 BOOT_WHICH.5 46.83,6.19 52.23,6.19 BOOT_WHICH.2
  Top 0.102: IC1.M6 v32.17,23.73
  Bottom 0.089: v38.26,23.34 33.34,23.34 33.36,23.36
  Bottom 0.102: v32.17,23.73 32.5,23.4 33.31,23.4 33.36,23.36
PB3  (via drill 0.15)
  Top 0.089: v20.8,24.92 22.54,26.67 24.13,26.67 24.13,26.65 | v17.94,23.18 14.76,23.18 12.38,20.8 v12.38,13.34 | v23.02,1.91 23.97,1.91 24.45,1.43 47.78,1.43 51.44,5.08 53.5,5.08 55.56,7.14 55.56,7.94 56.83,9.21 56.99,9.21 63.34,15.56 63.34,30.8 60.17,33.97 IO_EXT.30
  Top 0.152: IC1.A10 24.13,26.65
  Bottom 0.089: v20.8,24.92 19.05,23.18 v17.94,23.18 | v12.38,13.34 12.38,13.02 16.67,8.73 16.67,7.62 19.68,4.6 20.32,4.6 v23.02,1.91
PB5  (via drill 0.15)
  Top 0.089: IC1.A6 v22.59,24.05 | v33.48,49.73 34.2,50.45 U1.37
  Route15 0.089: v22.59,24.05 22.59,26.84 22.4,27.02 22.4,30.04 22.25,30.2 22.25,37.86 24.9,40.52 24.9,40.99 33.48,49.56 v33.48,49.73
PB6  (via drill 0.15)
  Top 0.089: v14.29,20.95 15.88,22.54 17.94,22.54 19.05,23.65 24.13,23.65 24.13,23.73 | v14.92,12.06 7.3,12.06 2.86,16.51 1.75,16.51 1.59,16.67 1.59,46.24 3.58,48.23 9.45,48.23 10.59,49.37 v15.88,49.37 | v21.43,49.37 23.18,49.37 23.34,49.53 U1.19
  Top 0.152: IC1.B6 25.02,23.73 24.13,23.73
  Bottom 0.089: v14.29,20.95 14.29,18.26 14.92,17.62 v14.92,12.06 | v21.43,49.37 v15.88,49.37
PB7  (via drill 0.15)
  Top 0.089: v21.27,23.02 24.13,23.02 24.13,23.07 | v18.57,7.94 18.57,6.19 v18.89,5.87 | v42.07,9.68 43.45,11.06 43.45,15.35 v54.13,26.04
  Top 0.152: IC1.B5 25.02,23.07 24.13,23.07
  Bottom 0.089: v21.27,23.02 18.57,20.32 18.57,10 17.94,9.37 17.94,8.57 v18.57,7.94 | v18.89,5.87 19.37,5.87 22.86,2.38 30.48,2.38 30.8,2.7 35.4,2.7 42.07,9.37 v42.07,9.68 | v54.13,26.04 54.13,28.89 55.88,30.64 58.1,30.64 58.58,31.11 58.58,35.56 57.63,36.51 IO_EXT.27
PB8  (via drill 0.15)
  Top 0.089: v20,23.34 24.13,23.34 24.13,23.4 | v17.62,21.91 16.03,21.91 v12.7,18.57 | v11.11,16.99 11.11,14.92 v8.89,12.7
  Top 0.152: IC1.A5 24.13,23.4
  Bottom 0.089: v20,23.34 18.57,21.91 v17.62,21.91 | v11.11,16.99 v12.7,18.57 | v8.89,12.7 8.89,12.22 20.16,0.95 56.2,0.95 57.31,2.06 57.31,5.56 61.28,9.53 62.39,9.53 63.66,10.79 63.66,33.02 60.17,36.51 IO_EXT.28
PB9  (via drill 0.15)
  Top 0.089: v12.7,18.1 15.72,21.11 17.46,21.11 18.73,22.38 24.13,22.38 24.13,22.43 | v12.06,13.02 v12.06,17.46 | v42.39,12.22 42.39,15.08 42.86,15.56 42.86,18.73 48.42,24.29 v48.42,30
  Top 0.152: IC1.B4 25.02,22.43 24.13,22.43
  Bottom 0.089: v12.06,17.46 v12.7,18.1 | v12.06,13.02 15.4,9.68 15.4,8.57 19.68,4.29 20.16,4.29 22.86,1.59 30,1.59 30.8,2.38 35.72,2.38 42.39,9.05 v42.39,12.22 | v48.42,30 57.47,39.05 IO_EXT.25
PB10  (via drill 0.15)
  Top 0.089: v36.35,27.46 35.88,27.94 34.45,27.94 34.45,27.95 | v53.5,32.23 46.35,39.37 42.39,39.37 41.75,40.01 41.75,42.39 42.07,42.7 42.07,61.28 v36.51,66.83 | v2.22,22.23 7.46,16.99 PROG.P6
  Top 0.152: IC1.R12 34.45,27.95
  Bottom 0.089: v36.35,27.46 36.35,27.62 36.99,28.26 50.8,28.26 53.5,30.96 v53.5,32.23 | v36.51,66.83 24.45,66.83 23.81,67.47 13.02,67.47 8.73,63.18 7.3,63.18 2.22,58.1 v2.22,22.23
PB11  (via drill 0.15)
  Top 0.089: v37.78,43.02 37.78,41.91 37.47,41.59 37.47,30.16 35.88,28.57 34.45,28.57 34.45,28.6 | v41.75,42.86 41.75,61.12 36.04,66.83 v20.48,66.83 | v5.56,17.46 7.46,15.56 PROG.P8
  Top 0.152: IC1.R13 34.45,28.6
  Bottom 0.089: v37.78,43.02 41.59,43.02 v41.75,42.86 | v20.48,66.83 14.92,61.28 7.62,61.28 3.49,57.15 3.49,37.15 5.56,35.08 v5.56,17.46
PB12  (via drill 0.15)
  Top 0.089: v36.83,27.62 36.2,28.26 34.45,28.26 34.45,28.27
  Top 0.152: IC1.P12 33.48,28.27 34.45,28.27
  Bottom 0.089: v36.83,27.62 38.58,27.62 38.89,27.94 44.61,27.94 44.93,27.62 50.8,27.62 56.67,33.5 56.67,36.99 57.63,37.94 58.9,37.94 60.01,39.05 IO_EXT.26
PB13  (via drill 0.15)
  Top 0.089: v34.77,30.96 35.4,30.96 36.04,30.32 36.04,30 34.92,28.89 34.45,28.89 34.45,28.93 | v28.1,35.24 v34.61,35.24 | v23.02,40.32 22.23,40.32 v19.37,43.18
  Top 0.152: IC1.P13 33.48,28.93 34.45,28.93
  Bottom 0.089: v34.77,30.96 34.77,33.5 34.61,33.66 v34.61,35.24 | v23.02,40.32 v28.1,35.24 | v19.37,43.18 19.37,44.13 6.35,57.15 SPI1.2
PB14  (via drill 0.15)
  Top 0.089: v35.72,30.16 34.77,29.21 34.45,29.21 34.45,29.25 | v37.15,34.45 v37.15,32.86 | v35.08,36.51 30.64,36.51 29.53,37.62 v27.15,37.62 | v24.13,40.64 22.38,40.64 v20.32,42.7
  Top 0.152: IC1.R14 34.45,29.25
  Bottom 0.089: v35.72,30.16 35.72,31.43 v37.15,32.86 | v37.15,34.45 36.99,34.45 35.08,36.35 v35.08,36.51 | v24.13,40.64 v27.15,37.62 | v20.32,42.7 20.32,44.45 SPI1.4
PB15  (via drill 0.15)
  Top 0.089: v35.08,30.48 34.45,30.48 34.41,30.51 | v35.72,33.18 v35.08,32.54 | v37.15,36.04 v35.56,34.45 | v38.42,35.88 38.42,37.62 39.37,38.58 v39.37,41.43 | v41.43,41.43 41.43,61.12 36.04,66.52 20.16,66.52 18.41,64.77 8.89,64.77 7.94,65.72 7.3,65.72 5.4,63.82 5.08,63.82 3.81,62.55 3.81,55.88 SPI1.1
  Top 0.102: IC1.R15 34.41,30.51
  Bottom 0.089: v35.08,32.54 v35.08,30.48 | v35.72,33.18 35.72,34.29 v35.56,34.45 | v37.15,36.04 38.26,36.04 v38.42,35.88 | v41.43,41.43 v39.37,41.43
PC0  (via drill 0.15)
  Top 0.089: v35.4,16.19 34.92,16.19 33.66,17.46 33.66,18.41 33.34,18.73 32.7,18.73 32.23,19.21 32.23,20.16 32.17,20.16 | v40.96,19.05 40.96,19.84 42.55,21.43 42.55,25.88 45.09,28.42 v45.09,29.37
  Top 0.152: IC1.M2 32.17,21.12 32.17,20.16
  Bottom 0.089: v35.4,16.19 38.1,16.19 v40.96,19.05 | v45.09,29.37 46.67,29.37 56.67,39.37 56.67,40.8 57.47,41.59 IO_EXT.23
PC1  (via drill 0.15)
  Top 0.089: v35.24,18.26 37.78,15.72 v37.78,15.56 | v44.93,19.21 45.4,19.21 53.98,27.78 58.1,27.78 58.9,28.57 58.9,40.48 60.01,41.59 IO_EXT.24
  Top 0.102: IC1.M3 v32.17,21.77
  Bottom 0.089: 32.66,20.16 33.02,20.16 34.92,18.26 v35.24,18.26 | v37.78,15.56 41.27,15.56 v44.93,19.21
  Bottom 0.102: v32.17,21.77 32.66,21.29 32.66,20.16
PC2  (via drill 0.15)
  Top 0.089: v34.92,19.05 34.92,17.62 38.1,14.45 v38.1,10.79 | v44.61,17.94 44.61,20.16 50.48,26.04 v50.48,29.69 | v55.4,34.61 55.4,42.07 57.47,44.13 IO_EXT.21
  Top 0.102: IC1.M4 v32.17,22.43
  Bottom 0.089: 34.45,21.94 34.45,21.59 34.92,21.11 v34.92,19.05 | v38.1,10.79 44.61,17.3 v44.61,17.94 | v55.4,34.61 v50.48,29.69
  Bottom 0.102: v32.17,22.43 32.4,22.43 32.7,22.12 33.29,22.12 33.48,21.94 34.45,21.94
PC3  (via drill 0.15)
  Top 0.089: v49.38,39.24 55.47,45.34 59.02,45.34 IO_EXT.22
  Top 0.102: IC1.M5 v32.17,23.07
  Route15 0.089: v49.38,39.24 43.8,33.66 43.8,33.06 43.3,32.56 42.94,32.56 36.97,26.59 36.97,26.55 33.79,23.37 32.7,23.37 32.41,23.07 v32.17,23.07
PC4  (via drill 0.15)
  Top 0.089: v45.09,27.94 v44.45,27.3
  Top 0.102: IC1.N5 v32.83,23.07
  Bottom 0.089: v44.45,27.3 43.66,27.3 39.21,22.86 33.5,22.86 33.34,23.02 33.35,23.03 | v45.09,27.94 50.8,27.94 56.36,33.5 56.36,36.99 57.63,38.26 58.1,38.26 58.58,38.73 58.58,42.07 57.31,43.34 57.15,43.34 56.67,43.81 56.67,48.42 57.47,49.21 IO_EXT.17
  Bottom 0.102: v32.83,23.07 33.31,23.07 33.35,23.03
PC5  (via drill 0.15)
  Top 0.089: v37.15,21.91 36.04,23.02 34.45,23.02 34.45,23.07 | v38.58,21.91 39.53,22.86 v41.27,22.86
  Top 0.152: IC1.P5 33.48,23.07 34.45,23.07
  Bottom 0.089: v38.58,21.91 v37.15,21.91 | v41.27,22.86 43.34,22.86 43.97,22.23 52.07,22.23 57.94,28.1 60.64,28.1 61.12,28.57 61.12,32.38 60.33,33.18 59.69,33.18 58.9,33.97 58.9,36.99 60.17,38.26 60.64,38.26 61.12,38.73 61.12,48.26 60.17,49.21 IO_EXT.18
PC6  (via drill 0.15)
  Top 0.089: v31.75,33.97 30.48,32.7 30.48,31.75 29.21,30.48 29.25,30.48 | v31.75,37.15 34.92,37.15 36.04,38.26 v36.04,39.21 | v42.55,40.64 44.77,40.64 55.88,51.75 57.47,51.75 IO_EXT.15
  Top 0.102: IC1.H15 29.25,30.48
  Bottom 0.089: v31.75,37.15 v31.75,33.97 | v36.04,39.21 37.47,40.64 v42.55,40.64
PC7  (via drill 0.15)
  Top 0.089: v29.69,31.59 28.57,30.48 28.6,30.48 | v27.94,33.34 29.53,34.92 34.77,34.92 36.51,36.67 v36.51,39.21 | v42.55,40.16 44.61,40.16 55.4,50.96 59.21,50.96 60.01,51.75 IO_EXT.16
  Top 0.102: IC1.G15 28.6,30.48
  Bottom 0.089: v27.94,33.34 v29.69,31.59 | v36.51,39.21 38.73,39.21 39.69,40.16 v42.55,40.16
PC8  (via drill 0.15)
  Top 0.089: v25.4,33.66 25.4,36.67 28.73,40.01 34.45,40.01 v36.51,42.07 | v42.23,42.39 45.56,42.39 57.47,54.29 IO_EXT.13 | v28.89,29.52 28.87,29.52
  Top 0.102: IC1.G14 28.87,29.52
  Bottom 0.089: v28.89,29.52 28.89,30.16 v25.4,33.66 | v36.51,42.07 36.99,42.07 37.31,42.39 v42.23,42.39
PC9  (via drill 0.15)
  Top 0.089: v29.21,32.7 28.26,31.75 28.26,30.48 28.27,30.48
  Top 0.102: IC1.F14 28.27,29.57 28.27,30.48
  Bottom 0.089: v29.21,32.7 29.21,33.18 22.7,39.69 22.7,53.18 20.64,55.24 20.24,55.24 18.3,57.19 18.3,57.51 25.24,64.45 46.2,64.45 57.15,53.5 59.21,53.5 60.01,54.29 IO_EXT.14
PC10  (via drill 0.15)
  Top 0.089: v22.54,30.32 23.34,29.53 24.13,29.53 24.13,29.57 | v20.95,30.16 20.32,30.16 19.68,29.53 v16.03,29.53
  Top 0.152: IC1.B14 25.02,29.57 24.13,29.57
  Bottom 0.089: v20.95,30.16 21.1,30.02 22.24,30.02 v22.54,30.32 | v16.03,29.53 16.03,36.35 6.03,46.35 6.03,48.58 SPI2.2
PC11  (via drill 0.15)
  Top 0.089: v21.91,30.33 21.91,30.16 23.18,28.89 24.13,28.89 24.13,28.93 | v20,39.53 v20.95,38.58
  Top 0.152: IC1.B13 25.02,28.93 24.13,28.93
  Bottom 0.089: v21.91,30.33 21.91,33.5 20.95,34.45 v20.95,38.58 | v20,39.53 20,40.01 19.21,40.8 16.35,40.8 SPI2.4
PC12  (via drill 0.15)
  Top 0.089: v21.27,29.37 22.7,27.94 24.13,27.94 24.13,27.95
  Top 0.152: IC1.A12 24.13,27.95
  Bottom 0.089: v21.27,29.37 20.64,30 20.64,36.35 19.37,37.62 15.08,37.62 6.35,46.35 6.35,49.53 5.4,50.48 4.76,50.48 4.13,49.85 4.13,47.94 SPI2.1
PC13  (via drill 0.15)
  Top 0.089: v26.67,18.41 26.67,20.16 26.65,20.16 | v41.12,12.86 v39.21,12.86 | v63.5,10.16 v63.02,10.64
  Top 0.152: IC1.D1 26.65,20.16
  Bottom 0.089: v26.67,18.41 26.67,16.67 34.77,8.57 35.08,8.57 39.21,12.7 v39.21,12.86 | v41.12,12.86 60.8,12.86 v63.02,10.64 | v63.5,10.16 64.14,10.79 64.14,52.07 60.17,56.04 58.42,56.04 57.63,56.83 IO_EXT.11
PC14  (via drill 0.15)
  Top 0.089: v27.3,19.21 27.3,20.16 | v46.51,19.84 54.13,27.46 58.1,27.46 59.21,28.57 59.21,39.53 60.48,40.8 60.64,40.8 61.44,41.59 61.44,55.56 60.17,56.83 IO_EXT.12
  Top 0.152: IC1.E1 27.3,20.16
  Bottom 0.089: v27.3,19.21 32.86,13.65 32.86,13.18 33.34,12.7 33.66,12.7 33.81,12.86 33.81,15.72 33.66,15.88 33.66,16.19 34.29,16.83 37.94,16.83 40.96,19.84 v46.51,19.84
PC15  (via drill 0.15)
  Top 0.089: v28.26,18.73 28.26,19.21 27.94,19.53 27.94,20.16 27.95,20.16 | v31.59,16.67 32.23,16.03 v33.97,16.03 | v63.34,55.09 v63.34,32.86
  Top 0.152: IC1.F1 27.95,20.16
  Bottom 0.089: v28.26,18.73 29.53,18.73 v31.59,16.67 | v33.97,16.03 34.45,16.03 35.24,15.24 41.43,15.24 45.4,19.21 60.33,19.21 63.34,22.23 v63.34,32.86 | v63.34,55.09 59.85,58.58 58.42,58.58 57.63,59.37 IO_EXT.9
PD0  (via drill 0.15)
  Top 0.089: v23.34,28.26 24.13,28.26 24.13,28.27 | v20.95,29.05 v22.07,27.94 | v19.84,30.16 18.84,30.16 v18.67,30.33 | v18.57,37.31 18.57,38.26 19.05,38.73 19.05,57.31 22.54,60.8 23.34,60.8 U1.5
  Top 0.152: IC1.B12 25.02,28.27 24.13,28.27
  Bottom 0.089: v23.34,28.26 22.38,28.26 v22.07,27.94 | v19.84,30.16 v20.95,29.05 | v18.67,30.33 18.67,33.72 18.57,33.81 v18.57,37.31
PD1  (via drill 0.15)
  Top 0.089: v22.07,29.53 v22.7,28.89 | v24.29,32.7 24.92,33.34 25.56,33.34 26.67,34.45 v26.67,37.15 | v22.54,58.74 23.02,59.21 23.34,59.21 U1.7
  Top 0.102: IC1.C12 v25.68,28.27
  Bottom 0.089: v22.7,28.89 23.18,28.89 23.65,28.42 24.13,28.42 24.13,28.44 | v22.07,29.53 22.54,30 22.7,30 24.29,31.59 v24.29,32.7 | v26.67,37.15 23.02,40.8 23.02,58.26 v22.54,58.74
  Bottom 0.102: v25.68,28.27 25.19,28.27 25.02,28.44 24.13,28.44
PD2  (via drill 0.15)
  Top 0.089: v26.99,27.62 26.67,27.94 IC1.D12 | v22.86,21.75 21.59,20.48 16.19,20.48 v15.88,20.8 | v13.65,37.31 13.65,38.73 17.46,42.55 v17.46,57.63
  Bottom 0.089: v26.99,27.62 26.99,26.83 25.4,25.24 25.4,24.29 v22.86,21.75 | v15.88,20.8 15.88,21.91 14.45,23.34 14.45,36.51 v13.65,37.31 | v17.46,57.63 24.92,65.09 53.18,65.09 57.78,60.48 59.05,60.48 60.01,59.53 IO_EXT.10
PD3  (via drill 0.15)
  Top 0.089: v18.26,27.3 v21.43,27.3 | v17.78,27.78 11.91,27.78 10.48,26.35 v8.41,26.35 | v23.65,67.15 52.39,67.15 57.47,62.07 IO_EXT.7
  Top 0.102: IC1.D11 v26.32,27.62
  Bottom 0.089: v21.43,27.3 22.86,27.3 23.65,28.1 24.13,28.1 24.13,28.11 | v17.78,27.78 v18.26,27.3 | v8.41,26.35 8.41,37.31 3.81,41.91 3.81,57.15 7.62,60.96 17.46,60.96 v23.65,67.15
  Bottom 0.102: v26.32,27.62 26,27.95 25.19,27.95 25.02,28.11 24.13,28.11
PD4  (via drill 0.15)
  Top 0.089: v15.72,22.86 v17.62,22.86 | v13.97,37.62 13.97,38.73 17.78,42.55 17.78,59.53 v19.21,60.96
  Top 0.102: IC1.D10 v26.32,26.98
  Bottom 0.089: v17.62,22.86 19.05,22.86 20.8,24.61 22.71,24.61 23.2,24.13 23.5,24.13 24.13,24.77 24.13,27.15 25.18,27.15 25.19,27.14 | v15.72,22.86 15.72,23.65 14.76,24.61 14.76,36.83 v13.97,37.62 | v19.21,60.96 23.97,65.72 55.09,65.72 57.78,63.02 59.05,63.02 60.01,62.07 IO_EXT.8
  Bottom 0.102: v26.32,26.98 25.35,26.98 25.19,27.14
PD5  (via drill 0.15)
  Top 0.089: v19.05,26.99 v22.86,26.99 | v12.54,28.26 v17.78,28.26 | v12.54,34.13 12.54,35.56 v17.14,40.16 | v22.07,51.12 22.86,51.91 23.34,51.91 U1.16
  Top 0.102: IC1.C11 v25.68,27.62
  Bottom 0.089: v22.86,26.99 23.65,27.78 24.13,27.78 24.13,27.79 | v17.78,28.26 v19.05,26.99 | v12.54,34.13 v12.54,28.26 | v17.14,40.16 19.53,40.16 19.68,40.01 19.68,39.37 19.84,39.21 20.16,39.21 20.95,40.01 20.95,47.31 22.07,48.42 v22.07,51.12
  Bottom 0.102: v25.68,27.62 25.19,27.62 25.02,27.79 24.13,27.79
PD6  (via drill 0.15)
  Top 0.089: v21.91,26.51 17.46,26.51 v16.83,25.88 | v18.26,36.99 18.26,38.42 v18.41,38.58 | v18.41,59.53 v18.41,39.53 | IC1.B11 25.68,26.98 25.68,25.84 25.51,25.68 23.86,25.68 v23.81,25.72
  Bottom 0.089: v23.81,25.72 23.81,25.24 23.65,25.08 23.34,25.08 v21.91,26.51 | v16.83,25.88 16.83,32.38 18.26,33.81 v18.26,36.99 | v18.41,39.53 v18.41,38.58 | v18.41,59.53 18.41,61.28 23.18,66.04 56.04,66.04 57.47,64.61 IO_EXT.5
PD7  (via drill 0.15)
  Top 0.089: v20.48,28.73 21.91,27.3 24.13,27.3 | v19.37,29.84 18.41,29.84 17.84,30.42 12.01,30.42 6.99,25.4 6.99,23.34 6.83,23.18 3.02,23.18 2.22,23.97 2.22,35.71 4.17,37.66 5.19,37.66 6.4,38.86 6.4,39.93 7.01,40.54 8.53,40.54 9.22,41.22 9.22,42.14 9.68,42.6 14.94,42.6 17.14,44.81 v17.14,60.33
  Top 0.152: IC1.A11 24.13,27.3
  Bottom 0.089: v19.37,29.84 v20.48,28.73 | v17.14,60.33 23.18,66.36 56.99,66.36 57.78,65.56 59.05,65.56 60.01,64.61 IO_EXT.6
PD8  (via drill 0.15)
  Top 0.089: 33.15,30.48 33.5,30.48 v33.97,30.96 | v31.11,48.58 31.11,57.47 34.45,60.8 34.92,60.8 U1.50
  Top 0.102: IC1.P15 33.15,30.48
  Bottom 0.089: v33.97,30.96 33.97,36.51 31.75,38.73 31.75,43.97 31.11,44.61 v31.11,48.58
PD9  (via drill 0.15)
  Top 0.089: v34.29,29.84 34.29,29.57 | v34.29,35.56 31.59,35.56 v31.27,35.88 | v30.48,42.86 v29.84,42.23 | v32.54,60.01 34.13,61.59 34.92,61.59 U1.51
  Top 0.152: IC1.P14 33.48,29.57 34.29,29.57
  Bottom 0.089: v34.29,35.56 v34.29,29.84 | v31.27,35.88 31.27,37.94 29.84,39.37 v29.84,42.23 | v30.48,42.86 29.84,43.5 29.84,57.31 v32.54,60.01
PD10  (via drill 0.15)
  Top 0.089: v32.38,33.66 32.38,31.75 32.54,31.59 32.54,30.48 32.5,30.48 | v32.7,61.91 33.97,63.18 34.92,63.18 U1.53
  Top 0.102: IC1.N15 32.5,30.48
  Bottom 0.089: v32.38,33.66 32.38,37.15 30.16,39.37 30.16,42.39 24.77,47.78 24.77,53.98 v32.7,61.91
PD11  (via drill 0.15)
  Top 0.089: v32.7,32.86 32.7,31.75 32.86,31.59 32.86,30.48 32.83,30.48 | v34.77,36.83 v32.07,36.83 | v42.55,39.69 44.45,39.69 55.4,50.64 60.33,50.64 61.12,51.44 61.12,54.77 59.85,56.04 59.69,56.04 59.21,56.52 59.21,64.93 60.48,66.2 60.64,66.2 61.12,66.67 61.12,67.47 60.48,68.1 58.58,68.1 57.63,67.15 IO_EXT.3
  Top 0.102: IC1.N14 32.83,29.57 32.83,30.48
  Bottom 0.089: v32.7,32.86 32.07,33.5 v32.07,36.83 | v34.77,36.83 34.45,37.15 34.45,37.62 35.72,38.89 38.73,38.89 39.53,39.69 v42.55,39.69
PD12  (via drill 0.15)
  Top 0.089: v35.24,38.89 v31.43,38.89 | v42.07,41.12 43.02,42.07 45.88,42.07 57.31,53.5 58.1,53.5 58.9,54.29 58.9,65.88 60.01,66.99 IO_EXT.4
  Top 0.102: IC1.N13 v32.83,28.93
  Bottom 0.089: 33.66,29.09 33.66,36.51 31.43,38.73 v31.43,38.89 | v35.24,38.89 37.47,41.12 v42.07,41.12
  Bottom 0.102: v32.83,28.93 33.31,28.93 33.48,29.09 33.66,29.09
PD14  (via drill 0.15)
  Top 0.089: v31.75,32.07 32.23,31.59 32.23,29.84 32.07,29.69 32.07,29.53 32.1,29.5 | v30.8,35.56 28.73,35.56 v27.15,37.15 | v24.45,62.71 23.97,63.18 23.5,63.18 U1.2
  Top 0.102: IC1.M14 32.1,29.5
  Bottom 0.089: v31.75,32.07 31.75,33.5 30.8,34.45 v30.8,35.56 | v27.15,37.15 23.81,40.48 23.81,62.07 v24.45,62.71
PD15  (via drill 0.15)
  Top 0.089: v31.43,31.59 31.59,31.43 31.59,29.84 31.43,29.69 31.43,29.53 31.45,29.5 | v30,33.34 v30.64,33.34 | v24.45,61.12 23.97,61.59 23.5,61.59 U1.4
  Top 0.102: IC1.L14 31.45,29.5
  Bottom 0.089: v31.43,31.59 31.43,32.54 v30.64,33.34 | v30,33.34 30,33.97 27.46,36.51 27.46,44.45 24.13,47.78 24.13,60.8 v24.45,61.12
PE0  (via drill 0.15)
  Top 0.089: v16.03,22.23 17.94,22.23 18.41,22.7 24.13,22.7 24.13,22.75 | v15.72,34.09 15.79,34.17 18.93,34.17 19.37,34.61 v21.27,34.61 | v22.38,52.23 22.86,52.7 23.34,52.7 U1.15
  Top 0.152: IC1.A4 24.13,22.75
  Bottom 0.089: v16.03,22.23 16.03,29.05 15.72,29.37 v15.72,34.09 | v21.27,34.61 21.27,47.31 22.38,48.42 v22.38,52.23
PE1  (via drill 0.15)
  Top 0.089: v16.03,20.16 21.59,20.16 22.86,21.43 23.02,21.43 23.65,22.07 24.13,22.07 24.13,22.1 | v14.13,33.62 14.13,33.74 14.99,34.61 v18.89,34.61 | v20.16,36.35 20.8,36.35 28.1,43.66 v30.16,43.66 | v33.97,51.91 34.92,51.91 U1.39
  Top 0.152: IC1.A3 24.13,22.1
  Bottom 0.089: v16.03,20.16 14.13,22.07 v14.13,33.62 | v18.89,34.61 18.89,35.08 v20.16,36.35 | v30.16,43.66 30.16,48.1 v33.97,51.91
PE4  (via drill 0.15)
  Top 0.089: v24.92,18.41 25.4,18.89 25.4,20.16 25.35,20.16 | v27.78,8.57 28.73,8.57 30,7.3 30,6.35 J1.21
  Top 0.152: IC1.B1 25.35,20.16
  Bottom 0.089: v24.92,18.41 24.92,11.91 26.99,9.84 26.99,9.37 v27.78,8.57
PE5  (via drill 0.15)
  Top 0.089: v24.13,18.1 25.08,19.05 25.08,20.16 25.02,20.16 | v25.72,8.26 25.72,6.35 J1.12
  Top 0.152: IC1.B2 25.02,21.12 25.02,20.16
  Bottom 0.089: v24.13,18.1 24.13,16.51 23.65,16.03 23.65,12.54 25.56,10.64 25.56,8.41 v25.72,8.26
PE6  (via drill 0.15)
  Top 0.089: 24.13,21.77 24.13,18.57 23.81,18.26 23.81,16.35 v24.29,15.88 | v26.04,7.94 26.04,6.35 J1.13
  Top 0.152: IC1.B3 25.02,21.77 24.13,21.77
  Bottom 0.089: v24.29,15.88 24.29,12.22 25.88,10.64 25.88,8.57 26.04,8.41 v26.04,7.94
PE7  (via drill 0.15)
  Top 0.089: v35.88,26.99 35.88,26.04 35.24,25.4 34.45,25.4 34.45,25.35 | v39.21,54.93 39.21,60.96 35.56,64.61 30,64.61 23.97,58.58 23.5,58.58 U1.8
  Top 0.152: IC1.R8 34.45,25.35
  Bottom 0.089: v35.88,26.99 35.88,27.46 38.89,30.48 41.59,30.48 44.45,33.34 44.45,49.69 v39.21,54.93
PE8  (via drill 0.15)
  Top 0.089: v35.08,25.08 34.45,25.08 34.45,25.02 | v43.66,27.62 43.66,33.5 v43.5,33.66 | v31.27,58.26 25.24,58.26 23.97,56.99 23.5,56.99 U1.10
  Top 0.152: IC1.P8 33.48,25.02 34.45,25.02
  Bottom 0.089: v35.08,25.08 35.88,25.08 36.04,24.92 40.96,24.92 v43.66,27.62 | v43.5,33.66 43.5,48.9 34.13,58.26 v31.27,58.26
PE9  (via drill 0.15)
  Top 0.089: v38.42,29.53 v38.42,32.07 | v27.46,56.2 23.5,56.2 U1.11 | v33.5,26.35 33.5,26.32
  Top 0.152: IC1.P9 33.48,26.32 33.5,26.32
  Bottom 0.089: v33.5,26.35 32.86,26.99 32.86,27.15 32.38,27.62 32.7,27.94 33.34,27.94 33.66,28.26 34.61,28.26 v38.42,32.07 | v38.42,29.53 39.69,29.53 40.32,30.16 42.39,30.16 46.67,34.45 46.67,48.26 34.29,60.64 31.91,60.64 v27.46,56.2
PE10  (via drill 0.15)
  Top 0.089: v34.92,26.35 34.61,26.04 34.45,26.04 34.45,26 | v37.78,38.26 v37.78,30.32 | v35.72,38.42 29.53,38.42 v28.73,39.21 | v24.45,53.82 23.97,54.29 23.5,54.29 U1.13
  Top 0.152: IC1.R9 34.45,26
  Bottom 0.089: v34.92,26.35 34.92,27.3 37.78,30.16 v37.78,30.32 | v37.78,38.26 37.62,38.26 37.47,38.42 v35.72,38.42 | v28.73,39.21 28.73,43.5 24.45,47.78 v24.45,53.82
PE11  (via drill 0.15)
  Top 0.089: v35.56,26.67 35.24,26.99 34.45,26.99 34.45,26.98 | v42.55,26.99 42.55,33.02 41.91,33.66 41.91,34.61 40.96,35.56 40.96,48.9 35.56,54.29 35.08,54.29 U1.42
  Top 0.152: IC1.P10 33.48,26.98 34.45,26.98
  Bottom 0.089: v35.56,26.67 36.2,26.67 36.51,26.35 39.21,26.35 39.85,26.99 v42.55,26.99
PE12  (via drill 0.15)
  Top 0.089: v35.56,26.19 35.08,26.67 34.45,26.67 34.45,26.65 | v40.01,26.67 40.01,28.57 40.32,28.89 v40.32,49.05 | v33.97,55.4 33.97,55.56 34.45,56.04 U1.44
  Top 0.152: IC1.R10 34.45,26.65
  Bottom 0.089: v35.56,26.19 35.72,26.19 35.88,26.04 39.37,26.04 v40.01,26.67 | v33.97,55.4 v40.32,49.05
PE13  (via drill 0.15)
  Top 0.089: v37.15,30.32 37.15,32.38 36.83,32.7 v36.83,33.5 | v34.29,36.04 31.59,36.04 31.43,36.2 30.48,36.2 v29.53,37.15 | v29.53,40.32 30.16,40.32 33.66,43.81 33.66,48.58 32.07,50.16 32.07,54.45 34.45,56.83 34.92,56.83 U1.45
  Top 0.102: IC1.N11 v32.83,27.62
  Bottom 0.089: v37.15,30.32 36.99,30.32 34.45,27.78 34.45,27.79 | v36.83,33.5 35.88,34.45 35.88,34.61 34.45,36.04 v34.29,36.04 | v29.53,40.32 v29.53,37.15
  Bottom 0.102: v32.83,27.62 33.31,27.62 33.48,27.79 34.45,27.79
PE14  (via drill 0.15)
  Top 0.089: v34.77,27.62 34.45,27.62 | v33.97,57.94 34.45,58.42 34.92,58.42 U1.47
  Top 0.152: IC1.P11 33.48,27.62 34.45,27.62
  Bottom 0.089: v34.77,27.62 37.15,30 37.31,30 37.47,30.16 37.47,30.48 39.53,32.54 41.75,32.54 43.18,33.97 43.18,48.1 36.2,55.09 36.2,55.72 v33.97,57.94
PE15  (via drill 0.15)
  Top 0.089: v36.67,27.15 36.2,27.15 36.04,27.3 34.45,27.3 | v43.18,32.86 v43.18,27.62 | v35.88,57.78 35.88,58.74 35.4,59.21 35.08,59.21 U1.48
  Top 0.152: IC1.R11 34.45,27.3
  Bottom 0.089: v36.67,27.15 39.37,27.15 39.85,27.62 v43.18,27.62 | v43.18,32.86 43.81,33.5 43.81,49.85 v35.88,57.78
PF0  (via drill 0.15)
  Top 0.089: v13.18,18.1 13.49,18.41 18.1,18.41 20.95,15.56 25.88,15.56 26.99,16.67 26.99,20.16 26.98,20.16 | v16.35,37.94 v13.18,34.77 | v20.64,37.94 21.91,37.94 v24.61,40.64 | v24.61,46.2 23.65,46.2 23.5,46.35 U1.23
  Top 0.152: IC1.E2 26.98,21.12 26.98,20.16
  Bottom 0.089: v13.18,34.77 v13.18,18.1 | v20.64,37.94 v16.35,37.94 | v24.61,46.2 v24.61,40.64
PF1  (via drill 0.15)
  Top 0.089: v40.16,20.95 v39.05,19.84 | v46.67,20.95 53.82,28.1 58.1,28.1 58.58,28.57 58.58,31.91 57.31,33.18 54.29,33.18 v46.35,41.12 | v26.35,46.99 25.88,46.99 24.61,45.72 23.5,45.72 U1.24
  Top 0.102: IC1.H3 v29.57,21.77
  Bottom 0.089: v39.05,19.84 36.99,17.78 31.91,17.78 31.75,17.94 31.75,18.1 29.69,20.16 29.69,21.11 29.72,21.14 | v46.67,20.95 v40.16,20.95 | v46.35,41.12 46.35,48.26 34.29,60.33 32.38,60.33 26.35,54.29 v26.35,46.99
  Bottom 0.102: v29.57,21.77 29.57,21.29 29.72,21.14
PF2  (via drill 0.15)
  Top 0.089: v30.16,15.88 30.16,16.35 29.53,16.99 29.53,20.16 29.57,20.16 | v28.26,17.78 28.26,17.3 25.4,14.45 21.75,14.45 18.1,18.1 15.24,18.1 v14.61,17.46 | v12.86,34.45 12.86,35.4 v17.14,39.69 | v19.37,39.85 21.27,39.85 v21.75,40.32 | v22.38,43.66 22.38,44.13 23.02,44.77 23.34,44.77 U1.25
  Top 0.152: IC1.H2 29.57,21.12 29.57,20.16
  Bottom 0.089: v28.26,17.78 v30.16,15.88 | v14.61,17.46 12.54,17.46 11.75,16.67 10.95,16.67 10.64,16.99 10.64,19.37 12.86,21.59 v12.86,34.45 | v17.14,39.69 18.1,39.69 18.26,39.85 v19.37,39.85 | v21.75,40.32 21.75,43.02 v22.38,43.66
PF3  (via drill 0.15)
  Top 0.089: v32.54,13.18 32.54,14.29 30.16,16.67 30.16,20.16 30.23,20.16 | v39.05,14.92 39.05,16.67 41.27,18.89 41.27,19.84 42.86,21.43 42.86,25.24 45.4,27.78 45.4,32.23 v42.55,35.08 | v37.15,43.02 v37.15,37.78 | v33.02,43.97 23.5,43.97 U1.26
  Top 0.152: IC1.J2 30.23,21.12 30.23,20.16
  Bottom 0.089: v32.54,13.18 33.34,12.38 33.81,12.38 36.35,14.92 v39.05,14.92 | v42.55,35.08 42.55,35.56 40.48,37.62 37.31,37.62 v37.15,37.78 | v37.15,43.02 36.83,43.02 35.88,43.97 v33.02,43.97
PF4  (via drill 0.15)
  Top 0.089: v32.07,18.1 32.54,17.62 v32.54,17.46 | v39.53,19.84 42.07,22.38 42.07,23.65 41.91,23.81 41.91,26.83 42.23,27.15 42.23,33.02 41.59,33.66 41.59,34.61 40.64,35.56 v40.64,42.7 | v35.88,43.5 35.4,43.97 35.08,43.97 U1.29
  Top 0.102: IC1.J3 v30.23,21.77
  Bottom 0.089: v32.07,18.1 30.32,19.84 30.32,21.75 v30.23,21.77 | v32.54,17.46 37.15,17.46 v39.53,19.84 | v40.64,42.7 36.67,42.7 v35.88,43.5
PF5  (via drill 0.15)
  Top 0.089: v34.29,18.1 34.29,18.89 34.92,19.53 v35.72,19.53 | v37.31,20.95 37.31,21.59 37.94,22.23 37.94,23.81 41.59,27.46 41.59,32.38 41.27,32.7 41.27,34.45 v40.64,35.08 | v41.91,38.26 v41.91,35.08 | v38.58,38.26 38.58,41.12 38.42,41.27 v38.42,43.34 | v35.88,44.29 35.4,44.77 35.08,44.77 U1.30
  Top 0.102: IC1.K3 v30.88,21.77
  Bottom 0.089: v34.29,18.1 33.02,18.1 30.96,20.16 30.96,21.27 30.92,21.24 | v35.72,19.53 36.51,20.32 36.51,20.64 36.83,20.95 v37.31,20.95 | v41.91,35.08 v40.64,35.08 | v38.58,38.26 v41.91,38.26 | v38.42,43.34 36.83,43.34 v35.88,44.29
  Bottom 0.102: 30.92,21.24 30.88,21.29 v30.88,21.77
PF6  (via drill 0.15)
  Top 0.089: v37.15,9.53 37.15,10.32 30.88,16.58 30.88,16.59 30.88,21.12 IC1.K2 | v37.15,7.14 37.15,6.35 J1.35
  Bottom 0.089: v37.15,7.14 v37.15,9.53
PF7
  Top 0.089: 30.55,20.16 30.48,20.16 30.48,16.67 36.83,10.32 36.83,9.37 38.58,7.62 38.58,6.35 J1.38
  Top 0.152: IC1.K1 30.55,20.16
PF8  (via drill 0.15)
  Top 0.089: v33.18,18.41 33.18,17.62 37.47,13.34 v37.47,9.21 | v37.94,7.14 37.94,6.51 38.1,6.35 J1.37
  Top 0.102: IC1.L3 v31.52,21.77